# EAGLE design Ideamart_NB-IoT_DevBoard_v1.1 (EAGLE 8.7.1)

## Sheet 1 of 4
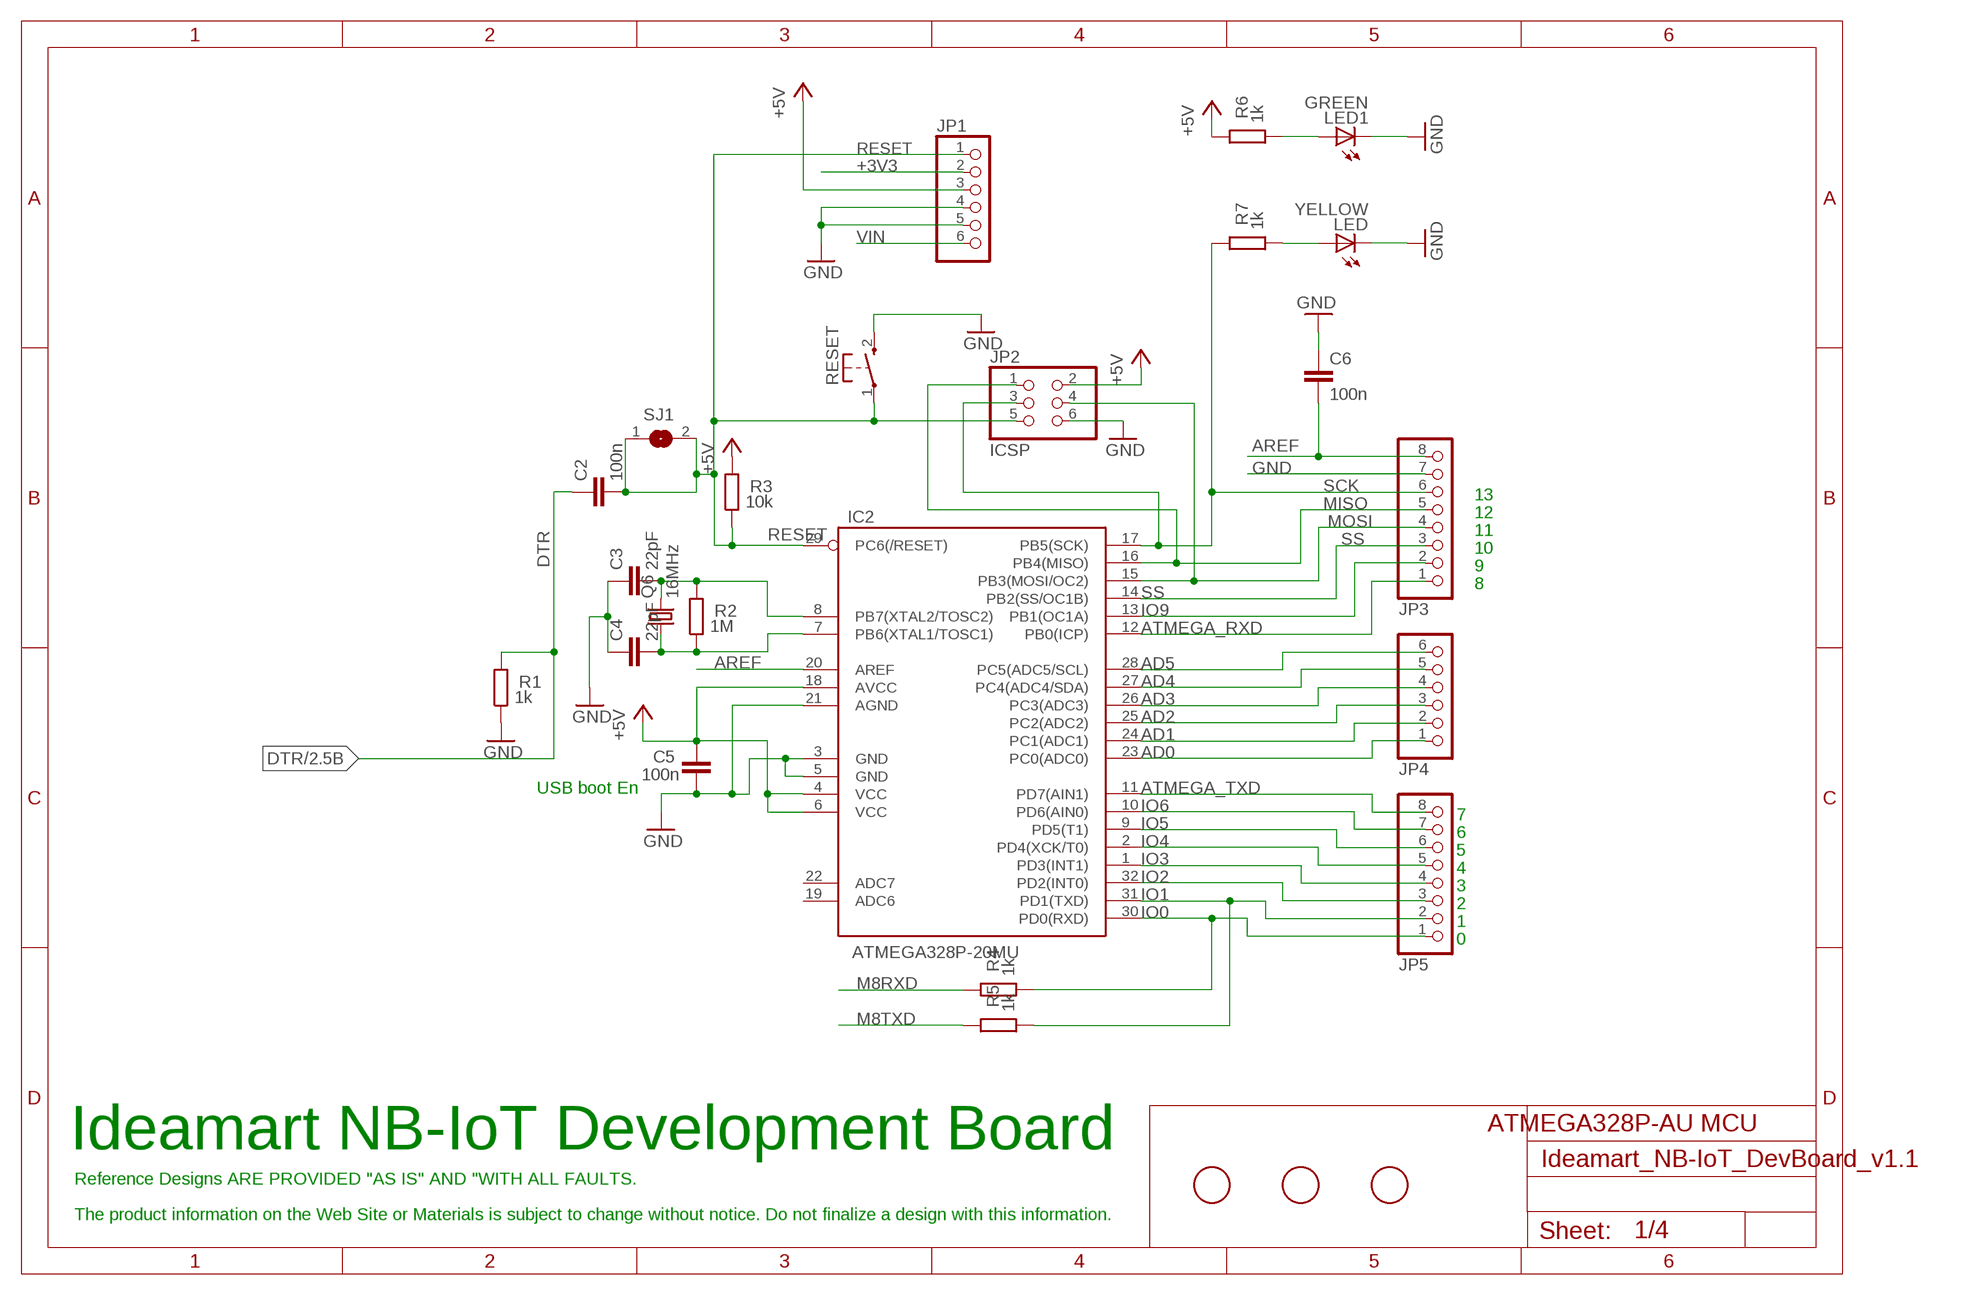
[diagram p0: schematic, sheet 1]

### Parts
C2  100n  C-EUC0805  [C0805]
C3  22pF  C-EUC0805  [C0805]
C4  22pF  C-EUC0805  [C0805]
C5  100n  C-EUC0805  [C0805]
C6  100n  C-EUC0805  [C0805]
IC2  ATMEGA328P-20MU  MEGA8-AI  [TQFP32-08]
JP1  PINHD-1X6  [1X06]
JP2  ICSP  PINHD-2X3  [2X03]
JP3  PINHD-1X8  [1X08]
JP4  PINHD-1X6  [1X06]
JP5  PINHD-1X8  [1X08]
LED  YELLOW  LEDCHIP-LED0805  [CHIP-LED0805]
LED1  GREEN  LEDCHIP-LED0805  [CHIP-LED0805]
M1  FIDUCIALMOUNT  [FIDUCIA-MOUNT]
M2  FIDUCIALMOUNT  [FIDUCIA-MOUNT]
M3  FIDUCIALMOUNT  [FIDUCIA-MOUNT]
Q6  16MHz  CRYSTALCTS406  [CTS406]
R1  1k  R-EU_R0805  [R0805]
R2  1M  R-EU_R0805  [R0805]
R3  10k  R-EU_R0805  [R0805]
R4  1k  R-EU_R0805  [R0805]
R5  1k  R-EU_R0805  [R0805]
R6  1k  R-EU_R0805  [R0805]
R7  1k  R-EU_R0805  [R0805]
RESET  KSS-2EG4430  [KSS-2EG4430]
SJ1  SJ  [SJ]

### Nets
+3V3: JP1.2 ; also sheet 3
+5V [usbvcc]: C5.2 IC2.4(VCC) IC2.6(VCC) IC2.18(AVCC) JP1.3 JP2.2 R3.2 R6.2 ; also sheet 2,3,4
AD0: IC2.23(PC0(ADC0)) JP4.1
AD1: IC2.24(PC1(ADC1)) JP4.2
AD2: IC2.25(PC2(ADC2)) JP4.3
AD3: IC2.26(PC3(ADC3)) JP4.4
AD4: IC2.27(PC4(ADC4/SDA)) JP4.5
AD5: IC2.28(PC5(ADC5/SCL)) JP4.6
AREF [aref]: C6.2 IC2.20(AREF) JP3.8
ATMEGA_RXD: IC2.12(PB0(ICP)) JP3.1 ; also sheet 4
ATMEGA_TXD: IC2.11(PD7(AIN1)) JP5.8 ; also sheet 4
DTR: C2.1 R1.2 ; also sheet 2
GND [gnd]: C3.1 C4.1 C5.1 C6.1 IC2.3(GND) IC2.5(GND) IC2.21(AGND) JP1.4 JP1.5 JP2.6 JP3.7 LED1.C LED.C R1.1 RESET.2(S) ; also sheet 2,3,4
IO0: IC2.30(PD0(RXD)) JP5.1 R4.1
IO1: IC2.31(PD1(TXD)) JP5.2 R5.1
IO2: IC2.32(PD2(INT0)) JP5.3
IO3: IC2.1(PD3(INT1)) JP5.4
IO4: IC2.2(PD4(XCK/T0)) JP5.5
IO5: IC2.9(PD5(T1)) JP5.6
IO6: IC2.10(PD6(AIN0)) JP5.7
IO9: IC2.13(PB1(OC1A)) JP3.2
M8RXD: R4.2 ; also sheet 2
M8TXD: R5.2 ; also sheet 2
MISO: IC2.16(PB4(MISO)) JP2.1 JP3.5
MOSI: IC2.15(PB3(MOSI/OC2)) JP2.4 JP3.4 ; also sheet 4
N$1: LED.A R7.1
N$3: LED1.A R6.1
RESET: C2.2 IC2.29(PC6(/RESET)) JP1.1 JP2.5 R3.1 RESET.1(P) SJ1.1 SJ1.2
SCK: IC2.17(PB5(SCK)) JP2.3 JP3.6 R7.2 ; also sheet 4
SS: IC2.14(PB2(SS/OC1B)) JP3.3
VIN [power]: JP1.6 ; also sheet 3
XTAL1: C4.2 IC2.7(PB6(XTAL1/TOSC1)) Q6.1 R2.1
XTAL2: C3.2 IC2.8(PB7(XTAL2/TOSC2)) Q6.3 R2.2
Unconnected: IC2.19(ADC6) IC2.22(ADC7)

### Notes on the sheet
- 13
- 12
- 11
- 10
- 9
- 8
- USB boot En
- 7
- 6
- 5
- 4
- 3
- 2
- 1
- 0
- ATMEGA328P-AU MCU
- Ideamart NB-IoT Development Board
- Reference Designs ARE PROVIDED "AS IS" AND "WITH ALL FAULTS.
- The product information on the Web Site or Materials is subject to change without notice. Do not finalize a design with this information.

## Sheet 2 of 4
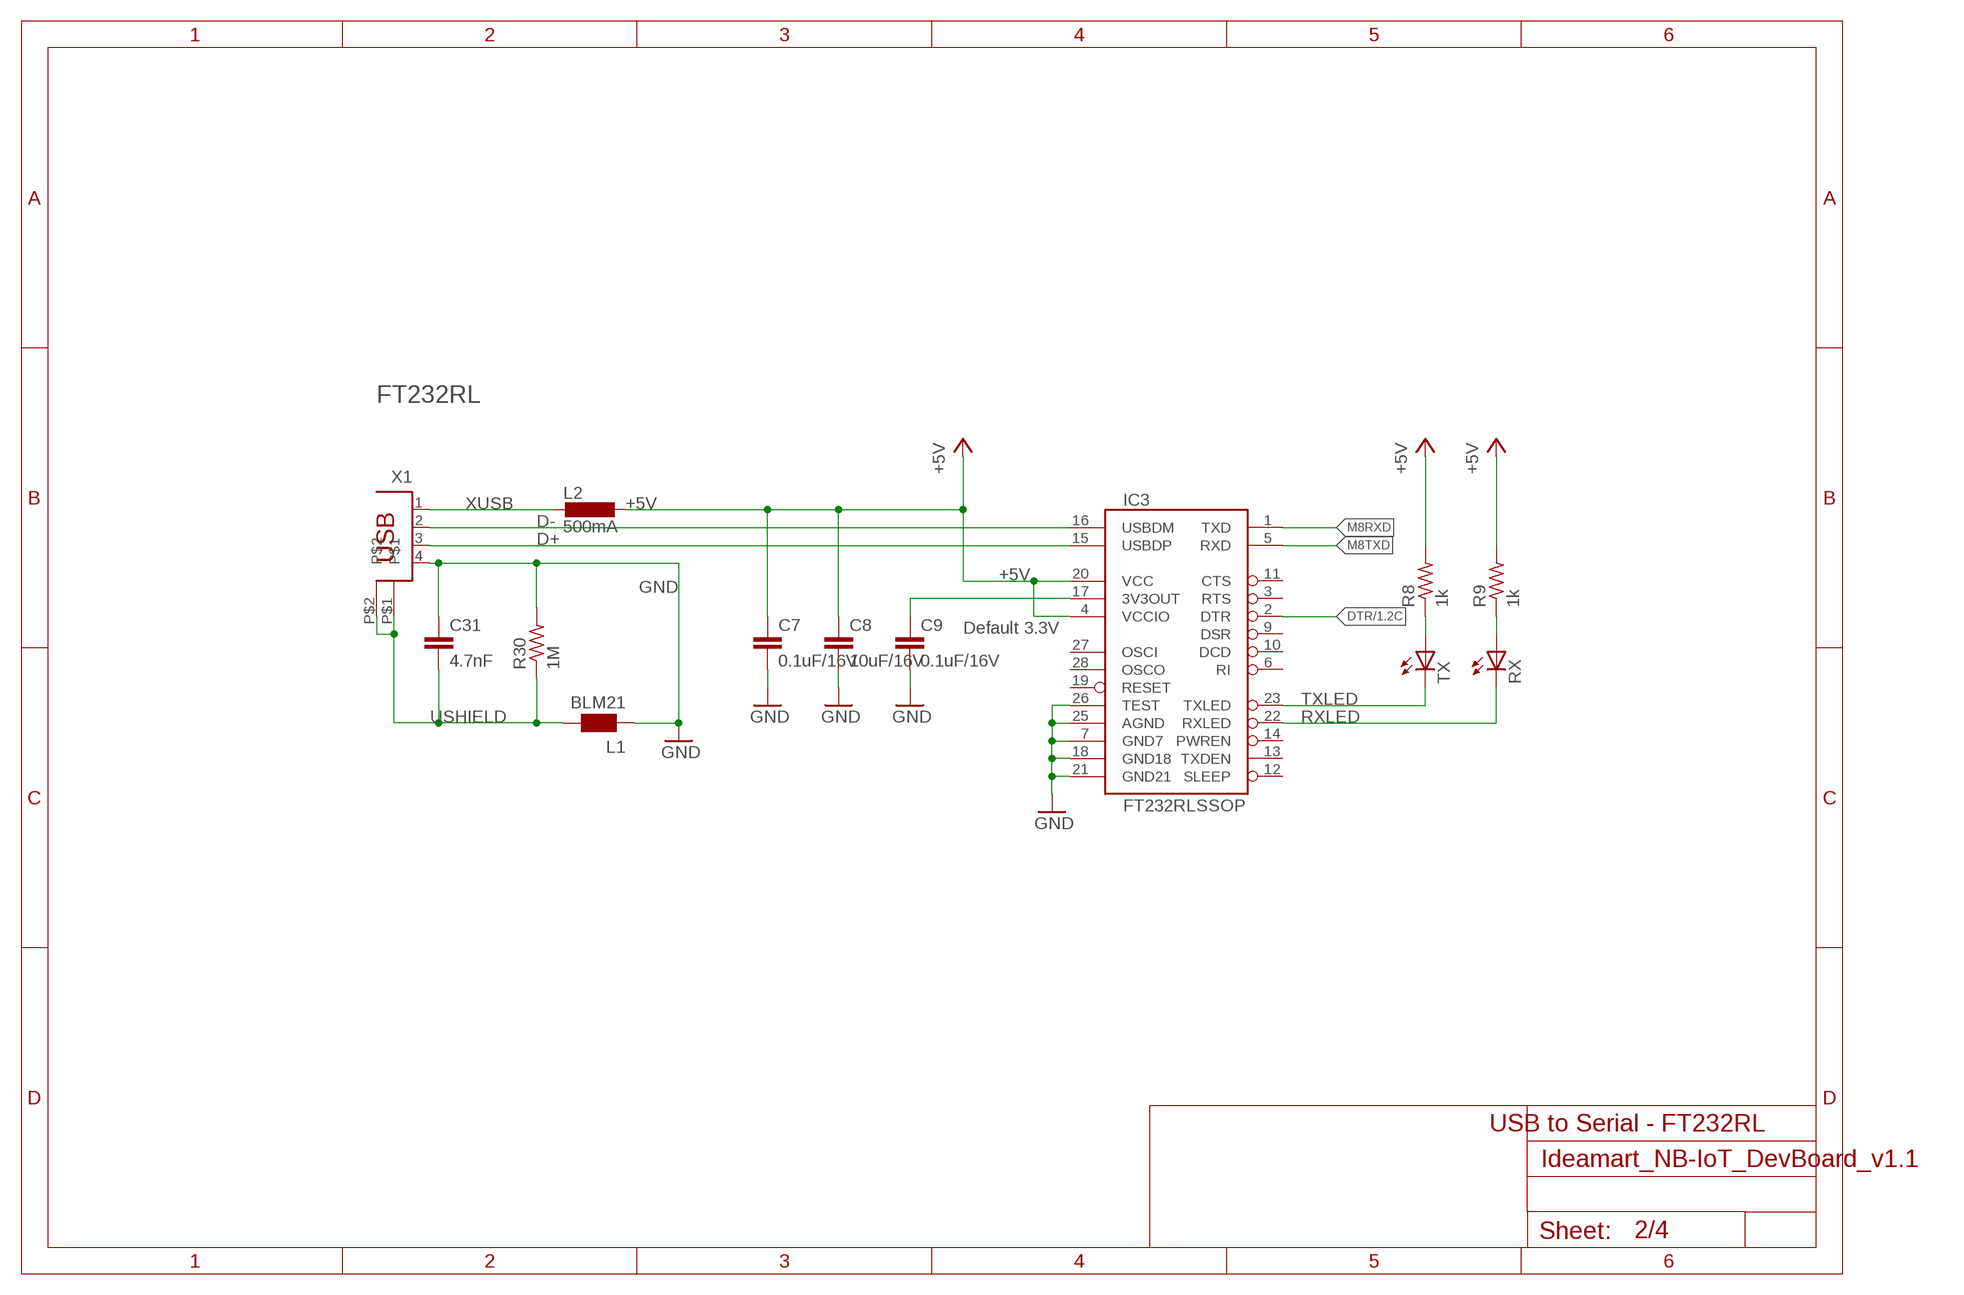
[diagram p1: schematic, sheet 2]

### Parts
C7  0.1uF/16V  C-EUC0805K  [C0805K]
C8  10uF/16V  C-EUC0805K  [C0805K]
C9  0.1uF/16V  C-EUC0805K  [C0805K]
C31  4.7nF  C-EUC0805K  [C0805K]
IC3  FT232RLSSOP  [SSOP28DB]
L1  BLM21  WE-CBF_0805  [0805]
L2  500mA  L-EUL1812  [L1812]
R8  1k  R-US_M0805  [M0805]
R9  1k  R-US_M0805  [M0805]
R30  1M  R-US_M0805  [M0805]
RX  LEDCHIP-LED0805  [CHIP-LED0805]
TX  LEDCHIP-LED0805  [CHIP-LED0805]
X1  PN61729  [PN61729]

### Nets
+5V [usbvcc]: C7.1 C8.1 IC3.4(VCCIO) IC3.20(VCC) L2.1 R8.2 R9.2 ; also sheet 1,3,4
D+: IC3.15(USBDP) X1.3
D-: IC3.16(USBDM) X1.2
DTR: IC3.2(DTR) ; also sheet 1
GND [gnd]: C7.2 C8.2 C9.2 C31.1 IC3.7(GND7) IC3.18(GND18) IC3.21(GND21) IC3.25(AGND) IC3.26(TEST) L1.1 R30.2 X1.4 ; also sheet 1,3,4
M8RXD: IC3.1(TXD) ; also sheet 1
M8TXD: IC3.5(RXD) ; also sheet 1
N$5: C9.1 IC3.17(3V3OUT)
N$9: R8.1 TX.A
N$11: R9.1 RX.A
RXLED: IC3.22(RXLED) RX.C
TXLED: IC3.23(TXLED) TX.C
USHIELD [gnd]: C31.2 L1.2 R30.1 X1.P$1 X1.P$2
XUSB [usbvcc]: L2.2 X1.1
Unconnected: IC3.3(RTS) IC3.6(RI) IC3.9(DSR) IC3.10(DCD) IC3.11(CTS) IC3.12(SLEEP) IC3.13(TXDEN) IC3.14(PWREN) IC3.19(RESET) IC3.27(OSCI) IC3.28(OSCO)

### Notes on the sheet
- FT232RL
- Default 3.3V
- USB to Serial - FT232RL

## Sheet 3 of 4
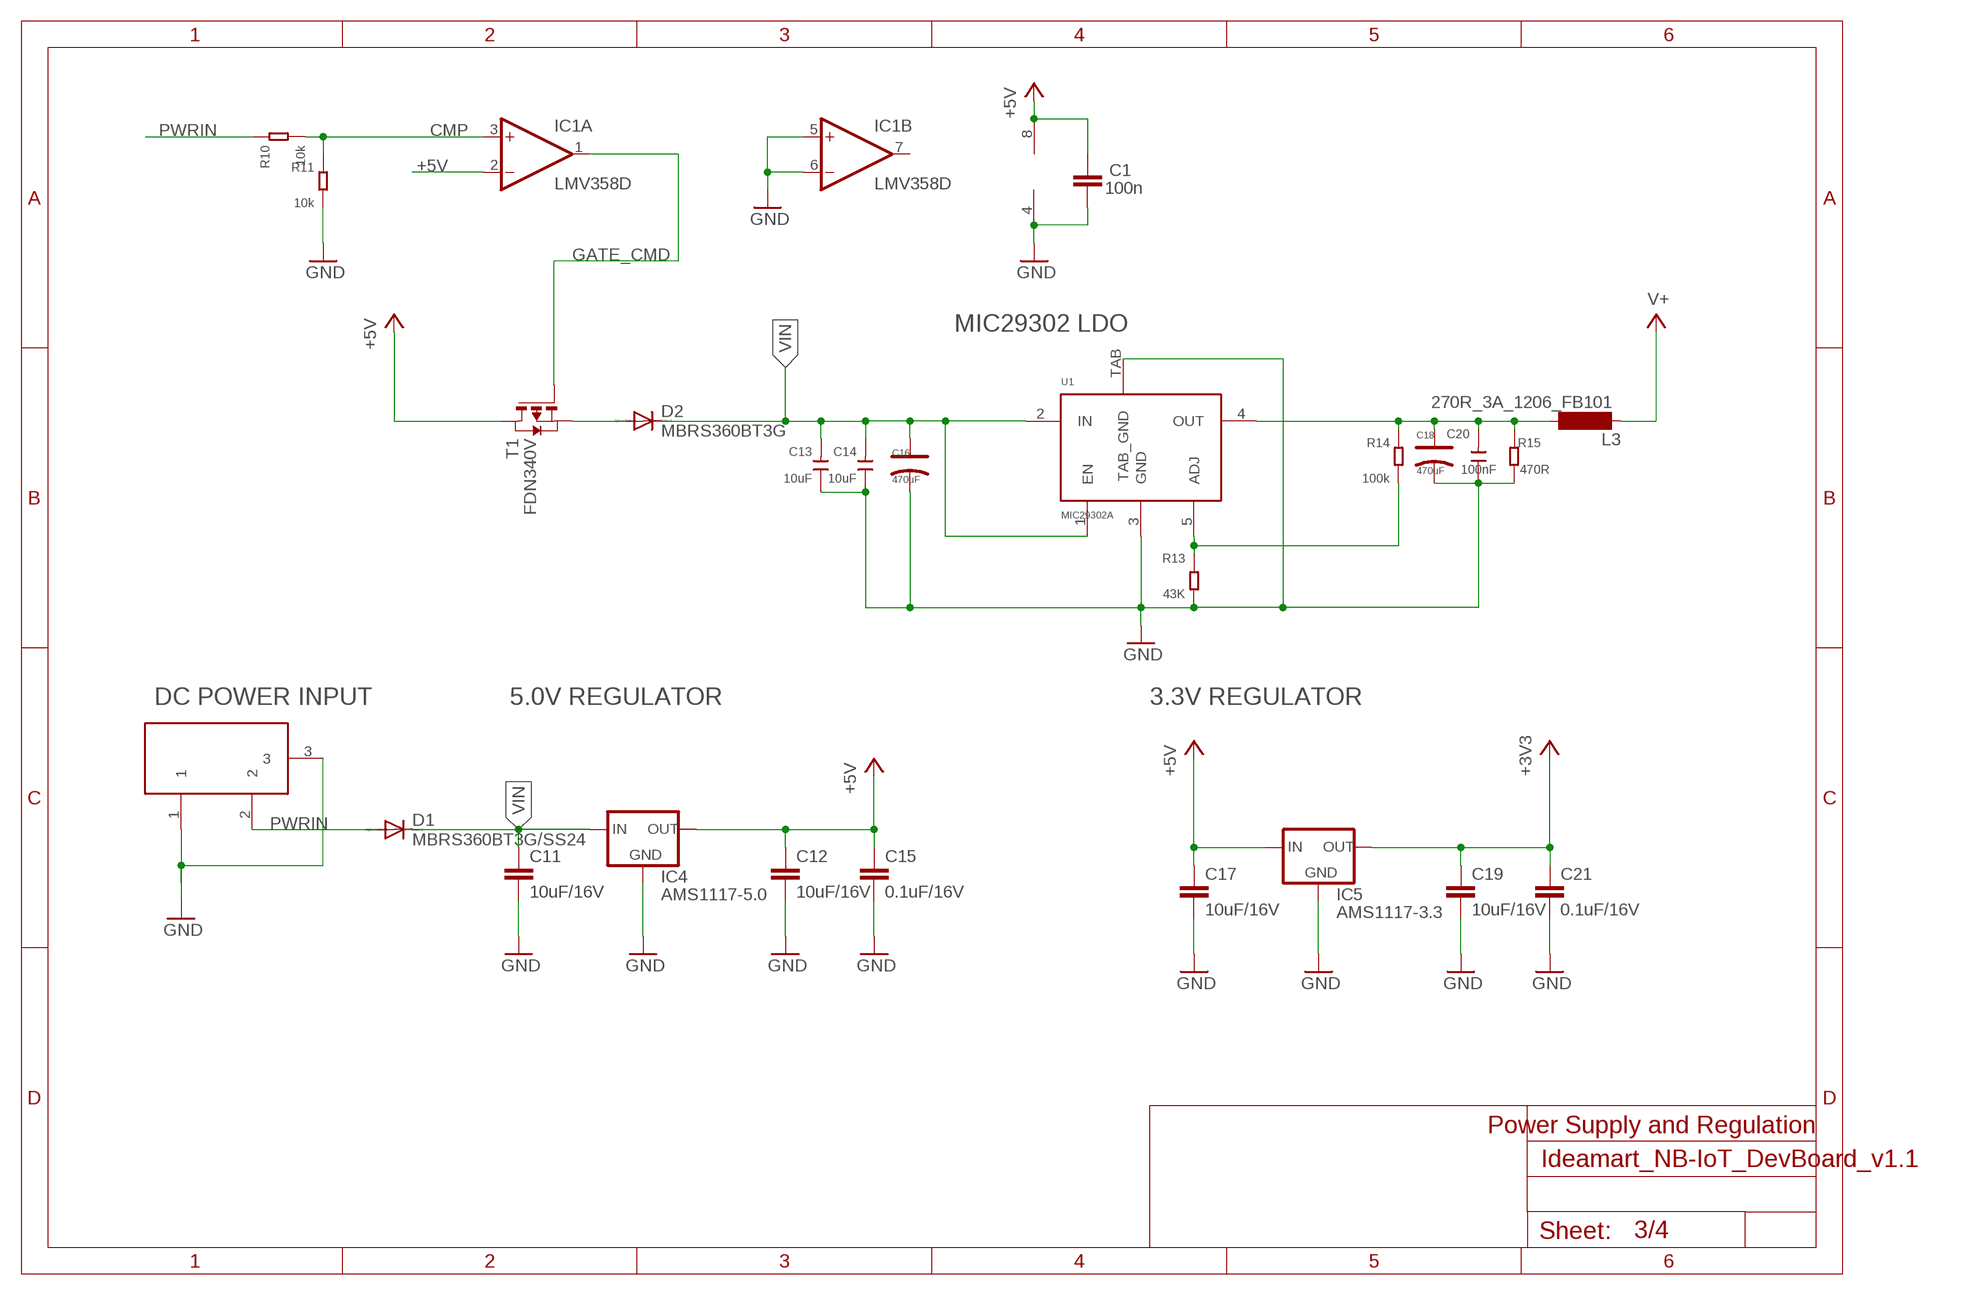
[diagram p2: schematic, sheet 3]

### Parts
C1  100n  C-EUC0805  [C0805]
C11  10uF/16V  C-EUC0805K  [C0805K]
C12  10uF/16V  C-EUC0805K  [C0805K]
C13  10uF  C-0805  [0805]
C14  10uF  C-0805  [0805]
C15  0.1uF/16V  C-EUC0805K  [C0805K]
C16  470uF  006-CAP_AVX_D  [AVX_D]
C17  10uF/16V  C-EUC0805K  [C0805K]
C18  470uF  006-CAP_AVX_D  [AVX_D]
C19  10uF/16V  C-EUC0805K  [C0805K]
C20  100nF  C-0805  [0805]
C21  0.1uF/16V  C-EUC0805K  [C0805K]
D1  MBRS360BT3G/SS24  DIODE-SMB  [SMB]
D2  MBRS360BT3G  DIODE-SMB  [SMB]
IC1  LMV358D  LM358D  [SO08]
IC4  AMS1117-5.0  LM1117  [SOT223]
IC5  AMS1117-3.3  LM1117  [SOT223]
L3  270R_3A_1206_FB101  SM-1206  [SM-1206]
R10  10k  R-0805  [0805]
R11  10k  R-0805  [0805]
R13  43K  R-0805  [0805]
R14  100k  R-0805  [0805]
R15  470R  R-0805  [0805]
T1  FDN340V  PMOSSOT23  [SOT-23]
U1  MIC29302A  [TO-263A]
X3  DC21MMX  [DC-21MM]

### Nets
+3V3: C19.1 C21.1 IC5.2(OUT) ; also sheet 1
+5V [usbvcc]: C1.2 C12.1 C15.1 C17.1 IC1.2(A:-IN) IC1.8(P:V+) IC4.2(OUT) IC5.3(IN) T1.1(D) ; also sheet 1,2,4
CMP: IC1.3(A:+IN) R10.1 R11.2
GATE_CMD: IC1.1(A:OUT) T1.3(G)
GND [gnd]: C1.1 C11.2 C12.2 C13.1 C14.1 C15.2 C16.- C17.2 C18.- C19.2 C20.1 C21.2 IC1.4(P:V-) IC1.5(B:+IN) IC1.6(B:-IN) IC4.1(GND) IC5.1(GND) R11.1 R13.1 R15.1 U1.3(GND) U1.TAB(TAB_GND) X3.1 X3.3 ; also sheet 1,2,4
N$2: R13.2 R14.1 U1.5(ADJ)
N$4: D2.A T1.2(S)
PWRIN [power]: D1.A R10.2 X3.2
V+: L3.1 ; also sheet 4
VIN [power]: C11.1 C13.2 C14.2 C16.+ D1.C D2.C IC4.3(IN) U1.1(EN) U1.2(IN) ; also sheet 1
VOUT: C18.+ C20.2 L3.2 R14.2 R15.2 U1.4(OUT)
Unconnected: IC1.7(B:OUT)

### Notes on the sheet
- MIC29302 LDO
- DC POWER INPUT | 5.0V REGULATOR | 3.3V REGULATOR
- Power Supply and Regulation

## Sheet 4 of 4
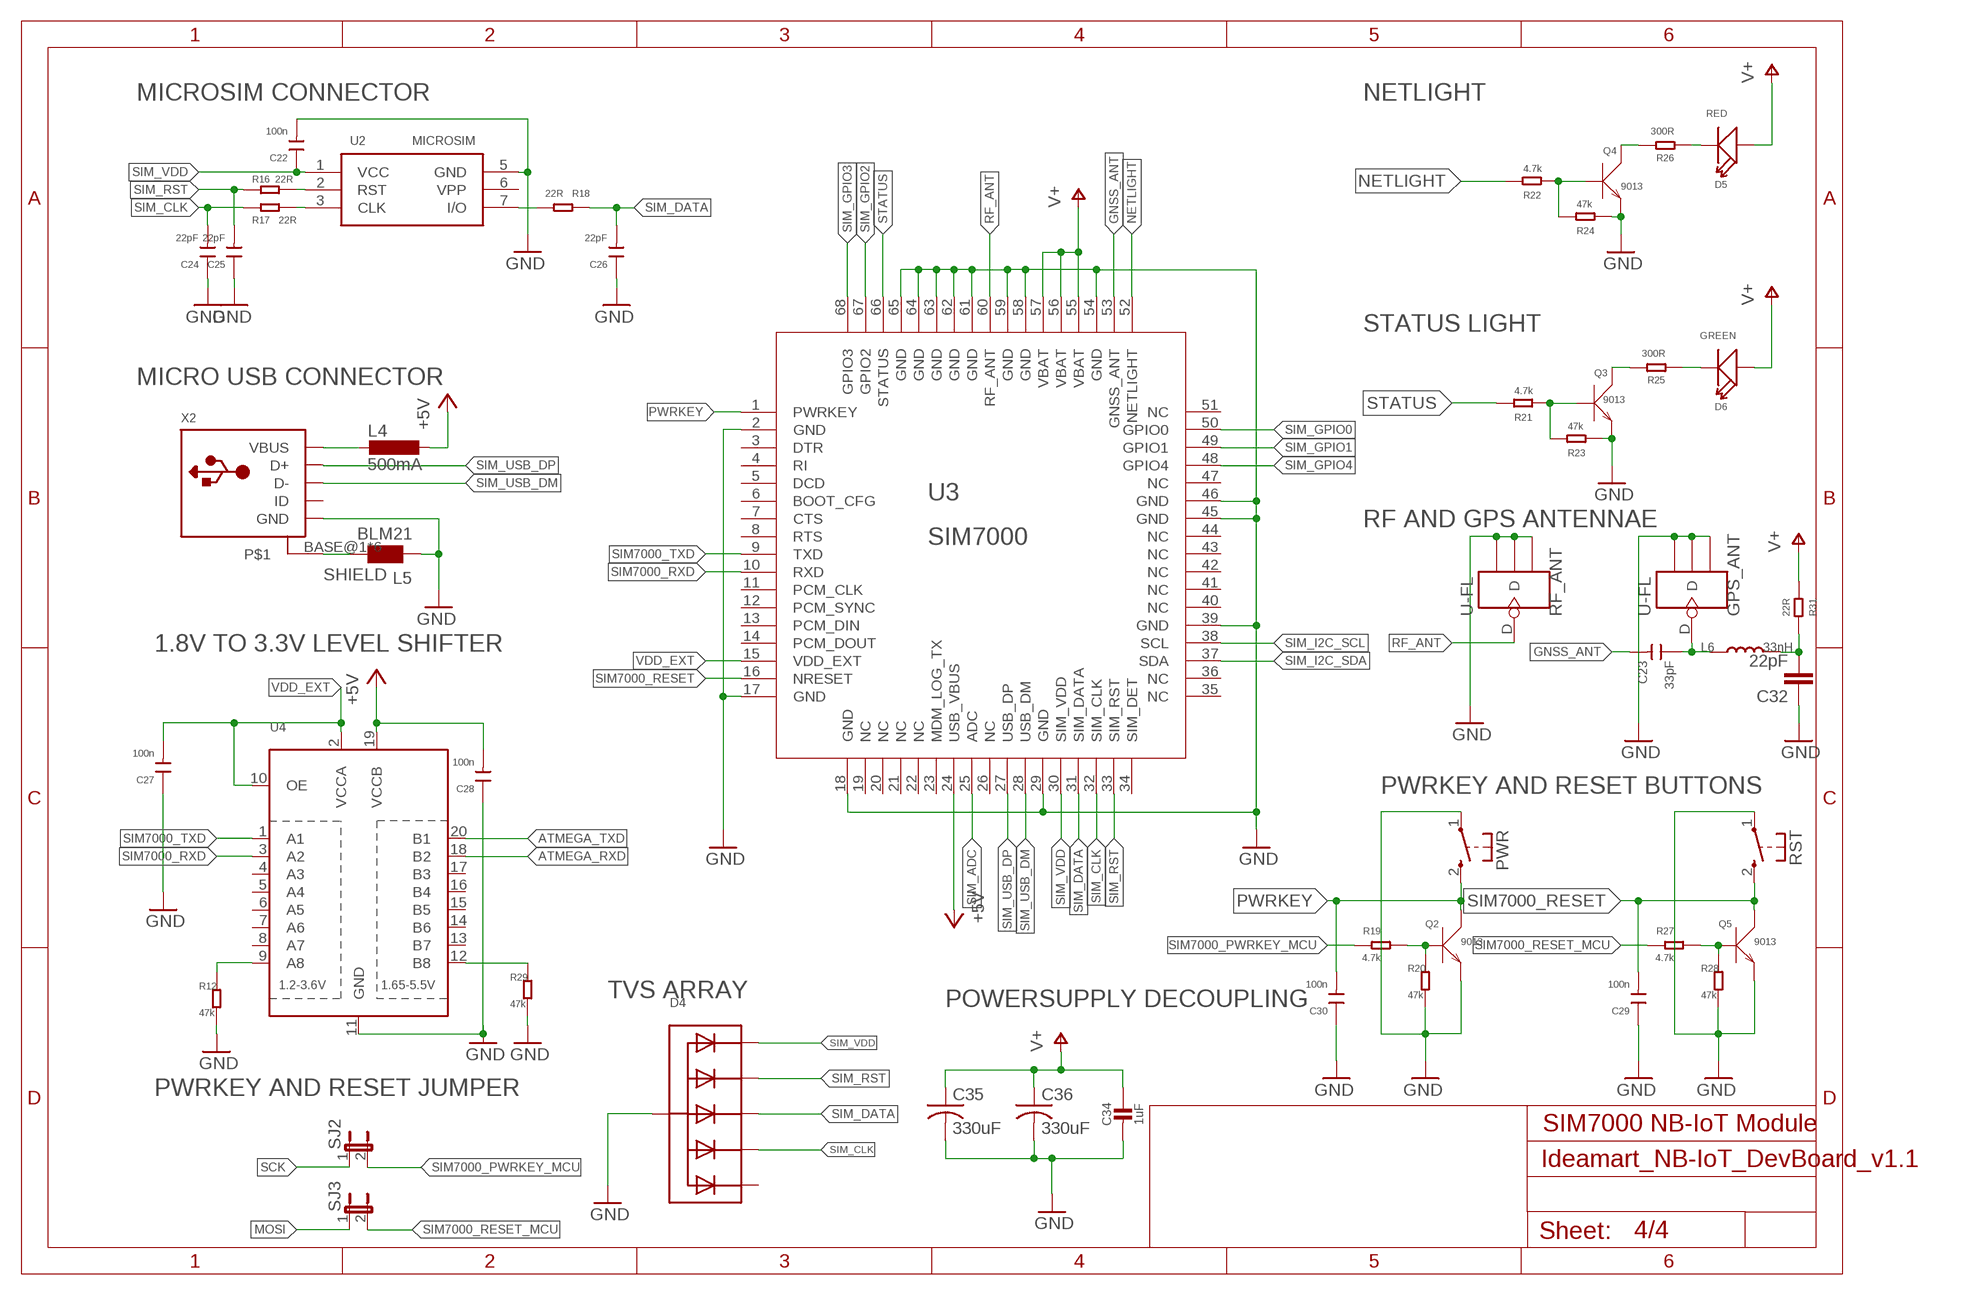
[diagram p3: schematic, sheet 4]

### Parts
C22  100n  C-0805  [0805]
C23  33pF  C-0805  [0805]
C24  22pF  C-0805  [0805]
C25  22pF  C-0805  [0805]
C26  22pF  C-0805  [0805]
C27  100n  C-0805  [0805]
C28  100n  C-0805  [0805]
C29  100n  C-0805  [0805]
C30  100n  C-0805  [0805]
C32  22pF  C-EUC0805  [C0805]
C34  1uF  CAP_CERAMIC_0805  [_0805]
C35  330uF  C-USC1210  [C1210]
C36  330uF  C-USC1210  [C1210]
D4  TVSARRAY_5LANE  [SOT363]
D5  RED  LED'0805'  [LED-0805]
D6  GREEN  LED'0805'  [LED-0805]
GPS_ANT  U-FL  ANTENNA-U-FL  [4P-U-FL]
L4  500mA  L-EUL1812  [L1812]
L5  BLM21  WE-CBF_0805  [0805]
L6  33nH  L0805  [L0805]
PWR  KSS-2EG4430  [KSS-2EG4430]
Q2  9013  TRANSISTOR-NPN-SOT23  [SOT23]
Q3  9013  TRANSISTOR-NPN-SOT23  [SOT23]
Q4  9013  TRANSISTOR-NPN-SOT23  [SOT23]
Q5  9013  TRANSISTOR-NPN-SOT23  [SOT23]
R12  47k  R-0805  [0805]
R16  22R  R-0805  [0805]
R17  22R  R-0805  [0805]
R18  22R  R-0805  [0805]
R19  4.7k  R-0805  [0805]
R20  47k  R-0805  [0805]
R21  4.7k  R-0805  [0805]
R22  4.7k  R-0805  [0805]
R23  47k  R-0805  [0805]
R24  47k  R-0805  [0805]
R25  300R  R-0805  [0805]
R26  300R  R-0805  [0805]
R27  4.7k  R-0805  [0805]
R28  47k  R-0805  [0805]
R29  47k  R-0805  [0805]
R31  22R  R-0805  [0805]
RF_ANT  U-FL  ANTENNA-U-FL  [4P-U-FL]
RST  KSS-2EG4430  [KSS-2EG4430]
SJ2  SPARKFUN-PASSIVES_JUMPER-PTH-2-NC  [SPARKFUN-PASSIVES_PTH-JUMPER-NC_BOTTOM_NO_SILK]
SJ3  SPARKFUN-PASSIVES_JUMPER-PTH-2-NC  [SPARKFUN-PASSIVES_PTH-JUMPER-NC_BOTTOM_NO_SILK]
U2  MICROSIM  [MICROSIM]
U3  SIM7000  [SIM7000]
U4  TXB0108PWR  [TSSOP20]
X2  USB_MICRO_20329_V2  [4UCONN_20329_V2]

### Nets
+5V [usbvcc]: C28.2 L4.1 U3.24(USB_VBUS) U4.19(VCCB) ; also sheet 1,2,3
ATMEGA_RXD: U4.18(B2) ; also sheet 1
ATMEGA_TXD: U4.20(B1) ; also sheet 1
GND [gnd]: C22.2 C24.1 C25.1 C26.1 C27.1 C28.1 C29.1 C30.1 C32.1 C34.2 C35.2 C36.2 D4.2(A) GPS_ANT.GND1 GPS_ANT.GND2 GPS_ANT.GND3 L5.1 PWR.1(P) Q2.2(E) Q3.2(E) Q4.2(E) Q5.2(E) R12.2 R20.2 R23.2 R24.2 R28.2 R29.2 RF_ANT.GND1 RF_ANT.GND2 RF_ANT.GND3 RST.1(P) U2.5(GND) U3.2(GND) U3.17(GND) U3.18(GND) U3.29(GND) U3.39(GND) U3.45(GND) U3.46(GND) U3.54(GND) U3.58(GND) U3.59(GND) U3.61(GND) U3.62(GND) U3.63(GND) U3.64(GND) U3.65(GND) U4.11(GND) X2.GND ; also sheet 1,2,3
GNSS_ANT [antenna]: C23.2 U3.53(GNSS_ANT)
MOSI: SJ3.1 ; also sheet 1
N$6: Q3.3(C) R25.2
N$7: D6.- R25.1
N$8: Q3.1(B) R21.2 R23.1
N$10: R18.2 U2.7(I/O)
N$12: R17.1 U2.3(CLK)
N$13: R16.1 U2.2(RST)
N$14: Q5.1(B) R27.2 R28.1
N$15: L4.2 X2.VBUS
N$16: Q4.3(C) R26.2
N$17: D5.- R26.1
N$18: Q4.1(B) R22.2 R24.1
N$19 [antenna]: C23.1 GPS_ANT.D L6.1
N$20: R12.1 U4.9(A8)
N$21: R29.1 U4.12(B8)
N$22: C32.2 L6.2 R31.1
N$36: Q2.1(B) R19.2 R20.1
NETLIGHT: R22.1 U3.52(NETLIGHT)
PWRKEY: C30.2 PWR.2(S) Q2.3(C) U3.1(PWRKEY)
RF_ANT [antenna]: RF_ANT.D U3.60(RF_ANT)
SCK: SJ2.1 ; also sheet 1
SHIELD: L5.2 X2.BASE@1 X2.BASE@2 X2.SPRT@1 X2.SPRT@2 X2.SPRT@3 X2.SPRT@4
SIM7000_PWRKEY_MCU: R19.1 SJ2.2
SIM7000_RESET: C29.2 Q5.3(C) RST.2(S) U3.16(NRESET)
SIM7000_RESET_MCU: R27.1 SJ3.2
SIM7000_RXD: U3.10(RXD) U4.3(A2)
SIM7000_TXD: U3.9(TXD) U4.1(A1)
SIM_ADC: U3.25(ADC)
SIM_CLK: C24.2 D4.5(C4) R17.2 U3.32(SIM_CLK)
SIM_DATA: C26.2 D4.4(C3) R18.1 U3.31(SIM_DATA)
SIM_GPIO0: U3.50(GPIO0)
SIM_GPIO1: U3.49(GPIO1)
SIM_GPIO2: U3.67(GPIO2)
SIM_GPIO3: U3.68(GPIO3)
SIM_GPIO4: U3.48(GPIO4)
SIM_I2C_SCL: U3.38(SCL)
SIM_I2C_SDA: U3.37(SDA)
SIM_RST: C25.2 D4.3(C2) R16.2 U3.33(SIM_RST)
SIM_USB_DM: U3.28(USB_DM) X2.D-
SIM_USB_DP: U3.27(USB_DP) X2.D+
SIM_VDD: C22.1 D4.1(C1) U2.1(VCC) U3.30(SIM_VDD)
STATUS: R21.1 U3.66(STATUS)
V+: C34.1 C35.1 C36.1 D5.+ D6.+ R31.2 U3.55(VBAT) U3.56(VBAT) U3.57(VBAT) ; also sheet 3
VDD_EXT: C27.2 U3.15(VDD_EXT) U4.2(VCCA) U4.10(OE)
Unconnected: D4.6(C5) U2.6(VPP) U3.3(DTR) U3.4(RI) U3.5(DCD) U3.6(BOOT_CFG) U3.7(CTS) U3.8(RTS) U3.11(PCM_CLK) U3.12(PCM_SYNC) U3.13(PCM_DIN) U3.14(PCM_DOUT) U3.19(NC) U3.20(NC) U3.21(NC) U3.22(NC) U3.23(MDM_LOG_TX) U3.26(NC) U3.34(SIM_DET) U3.35(NC) U3.36(NC) U3.40(NC) U3.41(NC) U3.42(NC) U3.43(NC) U3.44(NC) U3.47(NC) U3.51(NC) U4.4(A3) U4.5(A4) U4.6(A5) U4.7(A6) U4.8(A7) U4.13(B7) U4.14(B6) U4.15(B5) U4.16(B4) U4.17(B3) X2.ID

### Notes on the sheet
- MICROSIM CONNECTOR | NETLIGHT
- STATUS LIGHT
- MICRO USB CONNECTOR
- RF AND GPS ANTENNAE
- 1.8V TO 3.3V LEVEL SHIFTER
- PWRKEY AND RESET BUTTONS
- TVS ARRAY
- POWERSUPPLY DECOUPLING
- PWRKEY AND RESET JUMPER
- SIM7000 NB-IoT Module

## Library data of the parts
C1-C6 C32 = SmartPrj:C-EU: CAPACITOR, European symbol
C7-C9 C11 C12 C15 C17 C19 C21 C31 = rcl:C-EU: CAPACITOR, European symbol
C13 C14 C20 C22-C30 = discrete:C*: Ceramic Capacitors
C16 C18 = discrete:006-CAP*: Electrolytic Capacitors,Tantalum Capacitors and Super Capacitors
C34 = Adafruit111:CAP_CERAMIC: Ceramic Capacitors For new designs, use the packages preceded by an '_' character since they are more reliable: The following footprints should be used on most boards: _0402 - Standard footprint for regular board layouts _0603 - Standard footprint for regular board layouts _0805 - Standard footprint for regular board layouts _1206 - Standard footprint for regular board layouts For extremely tight-pitch boards where space is at a premium, the following 'micro-pitch' footprints can be used (smaller pads, no silkscreen outline, etc.): _0402MP - Micro-pitch footprint for very dense/compact boards _0603MP - Micro-pitch footprint for very dense/compact boards _0805MP - Micro-pitch footprint for very dense/compact boards _1206MP - Micro-pitch footprint for very dense/compact boards
C35 C36 = Adafruit SIM808 Breakout:C-US: CAPACITOR, American symbol
D1 D2 = diode:DIODE-: DIODE
D4 = Adafruit SIM808 Breakout:TVSARRAY_5LANE: Voltage Transient Suppressor Array SOT363 SMF05C - 100W 5V: Digikey - SMF05CT1GOSCT-ND
D5 D6 = discrete:LED*
GPS_ANT RF_ANT = Connector:ANTENNA-U-FL
IC1 = linear:LM358: OP AMP also LM158; LM258; LM2904 Source: http://cache.national.com/ds/LM/LM158.pdf
IC2 = idii:MEGA8: MICROCONTROLLER 8 Kbytes FLASH 1 kbytes SRAM 512 bytes EEPROM USART 6-channel 10 bit ADC 2-channel 8 bit ADC Source: avr.lbr
IC3 = FTDI Basic-v21-5V:FT232RL: USB UART FT232RL 4th Generation USB UART (USB <-> Serial) Controller. Spark Fun Electronics SKU : COM-00650
IC4 IC5 = v-reg-3:LM1117
JP1 JP4 = pinhead:PINHD-1X6: PIN HEADER
JP2 = pinhead:PINHD-2X3: PIN HEADER
JP3 JP5 = pinhead:PINHD-1X8: PIN HEADER
L1 L5 = wuerth-elektronik:WE-CBF: SMD EMI Suppression Ferrite Beads - excellent anti-EMI properties - low DCR - impedances till 3000 ohms - rated current up to 6 A
L2 L4 = rcl:L-EU: INDUCTOR, European symbol
L3 = inductor-neosid:SM-1206: INDUCTOR SMD chip inductor; OC_FARNELL: unknown; OC_NEWARK: unknown
L6 = GPRS+GSM+GPS Shield v1.0:L*
LED LED1 RX TX = led:LED: LED OSRAM: - CHIPLED LG R971, LG N971, LY N971, LG Q971, LY Q971, LO R971, LY R971 LH N974, LH R974 LS Q976, LO Q976, LY Q976 LO Q996 - Hyper CHIPLED LW Q18S LB Q993, LB Q99A, LB R99A - SideLED LS A670, LO A670, LY A670, LG A670, LP A670 LB A673, LV A673, LT A673, LW A673 LH A674 LY A675 LS A676, LA A676, LO A676, LY A676, LW A676 LS A679, LY A679, LG A679 - Hyper Micro SIDELED® LS Y876, LA Y876, LO Y876, LY Y876 LT Y87S - SmartLED LW L88C, LW L88S LB L89C, LB L89S, LG L890 LS L89K, LO L89K, LY L89K LS L896, LA L896, LO L896, LY L896 - TOPLED LS T670, LO T670, LY T670, LG T670, LP T670 LSG T670, LSP T670, LSY T670, LOP T670, LYG T670 LG T671, LOG T671, LSG T671 LB T673, LV T673, LT T673, LW T673 LH T674 LS T676, LA T676, LO T676, LY T676, LB T676, LH T676, LSB T676, LW T676 LB T67C, LV T67C, LT T67C, LS T67K, LO T67K, LY T67K, LW E67C LS E67B, LA E67B, LO E67B, LY E67B, LB E67C, LV E67C, LT E67C LW T67C LS T679, LY T679, LG T679 LS T770, LO T770, LY T770, LG T770, LP T770 LB T773, LV T773, LT T773, LW T773 LH T774 LS E675, LA E675, LY E675, LS T675 LS T776, LA T776, LO T776, LY T776, LB T776 LHGB T686 LT T68C, LB T68C - Hyper Mini TOPLED® LB M676 - Mini TOPLED Santana® LG M470 LS M47K, LO M47K, LY M47K Source: http://www.osram.convergy.de LUXEON: - LUMILED® LXK2-PW12-R00, LXK2-PW12-S00, LXK2-PW14-U00, LXK2-PW14-V00 LXK2-PM12-R00, LXK2-PM12-S00, LXK2-PM14-U00 LXK2-PE12-Q00, LXK2-PE12-R00, LXK2-PE12-S00, LXK2-PE14-T00, LXK2-PE14-U00 LXK2-PB12-K00, LXK2-PB12-L00, LXK2-PB12-M00, LXK2-PB14-N00, LXK2-PB14-P00, LXK2-PB14-Q00 LXK2-PR12-L00, LXK2-PR12-M00, LXK2-PR14-Q00, LXK2-PR14-R00 LXK2-PD12-Q00, LXK2-PD12-R00, LXK2-PD12-S00 LXK2-PH12-R00, LXK2-PH12-S00 LXK2-PL12-P00, LXK2-PL12-Q00, LXK2-PL12-R00 Source: www.luxeon.com KINGBRIGHT: KA-3528ASYC Source: www.kingbright.com
M1-M3 = SmartPrj:FIDUCIALMOUNT
PWR RESET RST = buttons:KSS-2EG4430: Size: 3x6mm Height: 5mm from PCB Rating: DC12v 50mA Travel: 0.25±0.10mm Operating Force: 180±50gf Return Force: 60gf min Contact resistance: 100m? max Insulation resistance: 100M? min Operating life?50,000 cycles
Q2-Q5 = discrete:TRANSISTOR-NPN*: NPN audion
Q6 = crystal:CRYSTAL: CRYSTAL; OC_FARNELL: unknown; OC_NEWARK: unknown
R1-R7 = SmartPrj:R-EU_: RESISTOR, European symbol
R8 R9 R30 = rcl:R-US_: RESISTOR, American symbol
R10-R29 R31 = discrete:R*
SJ1 = jumper:SJ: SMD solder JUMPER
SJ2 SJ3 = ESP8266_Sparkfun:SPARKFUN-PASSIVES_JUMPER-PTH-2-NC
T1 = zetex:PMOSSOT23: MOS FET; OC_FARNELL: unknown; OC_NEWARK: unknown
U1 = ICs_v54:MIC29302
U2 = GPRS+GSM+GPS Shield v1.0:MICROSIM
U3 = ICs_v54:SIM7000
U4 = adafruit:TXB0108PWR: 8-Bit Bi-Directional Level Shifter 1.2V-3.6V (VCCA) to 1.65V-5.5V (VCCB) bi-directional level shifter with auto direction sensing. Max data rate - VCCA 1.8V: 20Mbps (50ns), VCCA 3.3V: 100Mbps (10ns) Digikey: 296-21527-1-ND
X1 = SmartPrj:PN61729: BERG USB connector
X2 = Adafruit SIM808 Breakout:USB: USB Connectors USBMINIB - Surface Mount Female Mini-B USB Connector 4UConnector: 06564
X3 = powersupply:DC21MM

## Net classes
0 default: width 0.152 mm, clearance 0.152 mm
1 power: width 0.406 mm, drill 0.356 mm, clearance 0.152 mm
2 gnd: width 0.203 mm, drill 0.356 mm, clearance 0.152 mm
3 usbvcc: width 0.203 mm, drill 0.356 mm, clearance 0.152 mm
4 aref: width 0.203 mm, drill 0.356 mm, clearance 0.152 mm
5 antenna: width 0.33 mm, drill 0.356 mm, clearance 0.559 mm

## Board
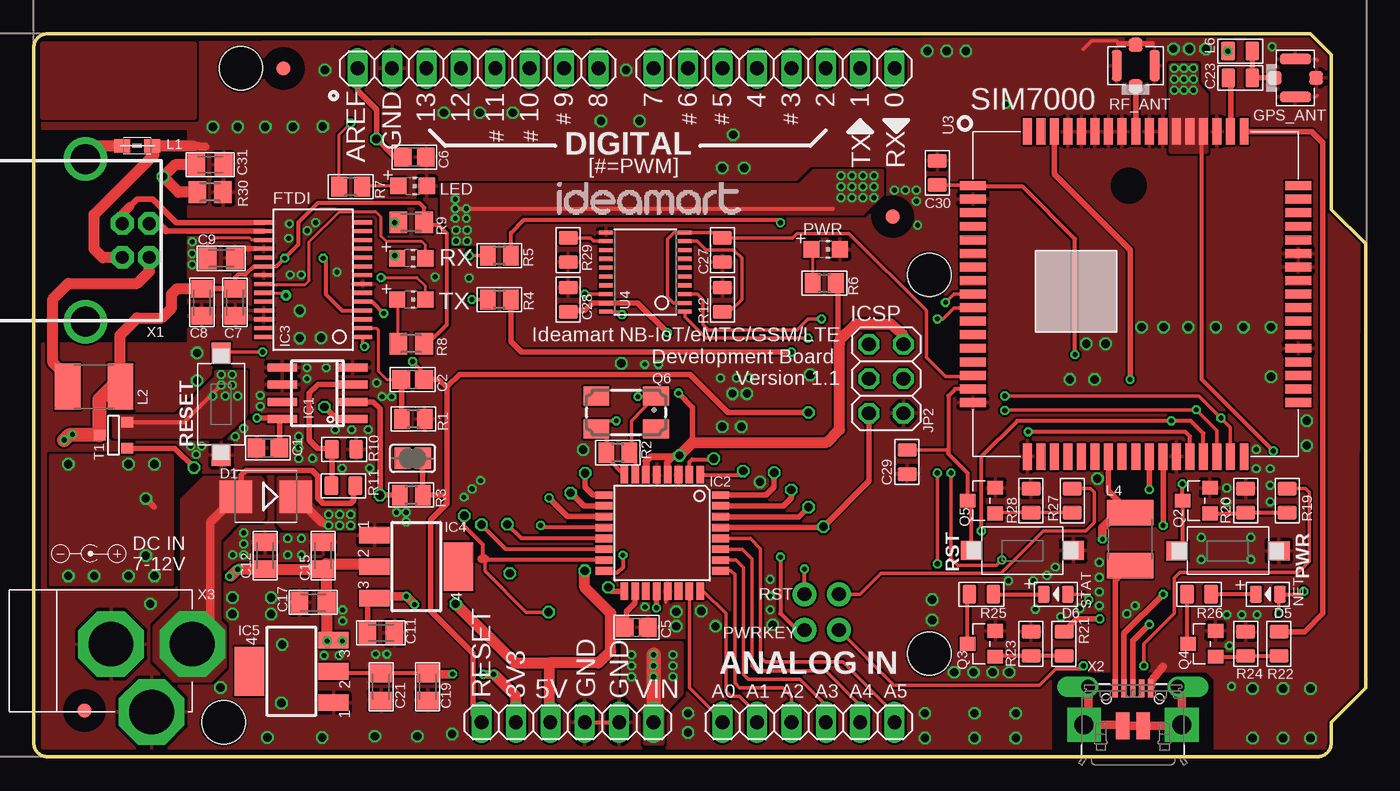
[diagram p4: board, top side]
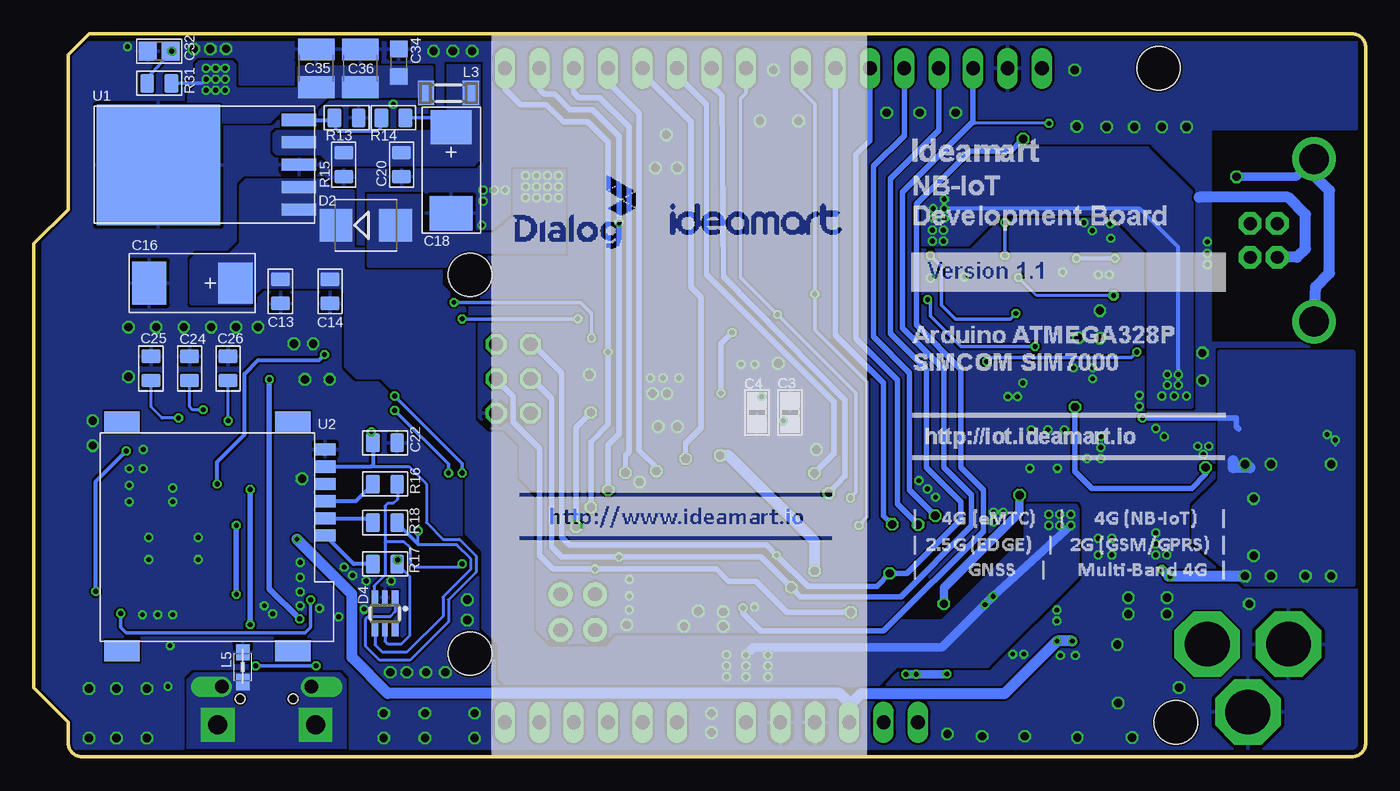
[diagram p5: board, bottom side, seen from below]

Size 98.25 x 53.34 mm. Coordinates in mm from the lower left corner, seen from the top.
Outline: 94.18,53.34 95.71,51.82 95.71,40.39 98.25,37.85 98.25,5.08 95.71,2.54 95.71,1 arc-90 94.71,0 1,0 arc-90 0,1 0,52.34 arc-90 1,53.34 94.18,53.34
Copper layers (1*16): Top 0.035mm / dielectric 1.5mm / Bottom 0.035mm
Design rules "default *": minimum track width 6mil, minimum drill 14mil, track to track 6mil, track to pad 6mil, pad to pad 6mil, via to via 6mil, smd to smd 6mil, copper to edge 6mil, drill to drill 6mil, minimum pad ring 6mil, minimum via ring 6mil, stop-mask expansion 4mil, vias tented up to drill 24mil, thermal gap 10mil
Holes 3.2 mm at 66.06,35.56 66.06,7.62 15.26,50.8 13.99,2.54
vRestrict: area 22.9,44.1 to 24.7,49.1; area 25.4,45.5 to 27.1,49.1; area 28.5,45.3 to 29.6,48.8; area 31,45.3 to 32.2,48.8; area 33.6,45.3 to 34.7,48.8; area 36.1,45.3 to 37.2,48.8; area 38.8,47.2 to 39.9,48.8; area 40.3,45.1 to 47.6,46.9; area 60.3,44.2 to 61.7,46.7; area 62.9,44.2 to 64.3,46.7; area 61.4,35.8 to 64.8,37.2; area 0.7,21.8 to 2.1,30.1; 14 more areas

### Footprints (pad centres in the part's own frame; a part is rotated, then mirrored left to right if it is on the bottom)
C0805 = smd 1.3 x 1.4: 1 -0.85,0; 2 0.85,0
C0805K = smd 1.3 x 1.6: 1 -1,0; 2 1,0
0805 = smd 1.016 x 1.397: 1 -0.889,0; 2 0.889,0
AVX_D = smd 2.54 x 3.048: + -3.175,0 | smd 2.54 x 3.175: - 3.175,0
_0805 = smd 1.2 x 1.3: 1 -1.016,0; 2 1.016,0
C1210 = smd 1.6 x 2.7: 1 -1.4,0; 2 1.4,0
SMB = smd 2.4 x 2.4: A 2.2,0; C -2.2,0
SOT363 = smd 0.5 x 1: 1 -0.75,-1.2; 3 0.75,-1.2; 4 0.75,1.2; 6 -0.75,1.2 | smd 0.4 x 1: 2 0,-1.2; 5 0,1.2
LED-0805 = smd 0.889 x 1.27: + -0.889,0; - 0.889,0
4P-U-FL = smd 1.016 x 1.016: D -1.524,0; GND3 1.524,0 | smd 2.286 x 0.762: GND1 0,1.397; GND2 0,-1.397
SO08 = smd 0.6 x 2.2: 1 -1.905,-2.6; 2 -0.635,-2.6; 3 0.635,-2.6; 4 1.905,-2.6; 5 1.905,2.6; 6 0.635,2.6; 7 -0.635,2.6; 8 -1.905,2.6
TQFP32-08 = smd 1.27 x 0.559: 1 -4.293,2.8; 2 -4.293,2; 3 -4.293,1.2; 4 -4.293,0.4; 5 -4.293,-0.4; 6 -4.293,-1.2; 7 -4.293,-2; 8 -4.293,-2.8; 17 4.293,-2.8; 18 4.293,-2; 19 4.293,-1.2; 20 4.293,-0.4; 21 4.293,0.4; 22 4.293,1.2; 23 4.293,2; 24 4.293,2.8 | smd 0.559 x 1.27: 9 -2.8,-4.293; 10 -2,-4.293; 11 -1.2,-4.293; 12 -0.4,-4.293; 13 0.4,-4.293; 14 1.2,-4.293; 15 2,-4.293; 16 2.8,-4.293; 25 2.8,4.293; 26 2,4.293; 27 1.2,4.293; 28 0.4,4.293; 29 -0.4,4.293; 30 -1.2,4.293; 31 -2,4.293; 32 -2.8,4.293
SSOP28DB = smd 0.3 x 1.397: 1 -4.225,-3.656; 2 -3.575,-3.656; 3 -2.925,-3.656; 4 -2.275,-3.656; 5 -1.625,-3.656; 6 -0.975,-3.656; 7 -0.325,-3.656; 8 0.325,-3.656; 9 0.975,-3.656; 10 1.625,-3.656; 11 2.275,-3.656; 12 2.925,-3.656; 13 3.575,-3.656; 14 4.225,-3.656; 15 4.225,3.656; 16 3.575,3.656; 17 2.925,3.656; 18 2.275,3.656; 19 1.625,3.656; 20 0.975,3.656; 21 0.325,3.656; 22 -0.325,3.656; 23 -0.975,3.656; 24 -1.625,3.656; 25 -2.275,3.656; 26 -2.925,3.656; 27 -3.575,3.656; 28 -4.225,3.656
SOT223 = smd 1.219 x 2.235: 1 -2.311,-3.099; 2 0,-3.099; 3 2.311,-3.099 | smd 3.6 x 2.2: 4 0,3.099
1X06 = drill 1.016 long: 1 -6.35,0; 2 -3.81,0; 3 -1.27,0; 4 1.27,0; 5 3.81,0; 6 6.35,0
2X03 = drill 1.016 octagon: 1 -2.54,-1.27; 2 -2.54,1.27; 3 0,-1.27; 4 0,1.27; 5 2.54,-1.27; 6 2.54,1.27
1X08 = drill 1.016 long: 1 -8.89,0; 2 -6.35,0; 3 -3.81,0; 4 -1.27,0; 5 1.27,0; 6 3.81,0; 7 6.35,0; 8 8.89,0
0805' = smd 1.2 x 1: 1 -1.1,0; 2 1.1,0
L1812 = smd 1.9 x 3.4: 1 -1.95,0; 2 1.95,0
SM-1206 = smd 1.2 x 1.8: 1 -1.65,0; 2 1.65,0
L0805 = smd 1.016 x 1.397: 1 -0.889,0; 2 0.889,0
CHIP-LED0805 = smd 1.2 x 1.2: A 0,-1.05; C 0,1.05
FIDUCIA-MOUNT = smd 1.016 x 1.016: P$1 0,0
KSS-2EG4430 = smd 1.6 x 1.4: 1 -3.75,0; 2 3.75,0
SOT23 = smd 1.016 x 1.143: 1 -0.95,-1.016; 2 0.95,-1.016; 3 0,1.016
CTS406 = smd 1.9 x 1.4: 1 -2.2,-1.2; 2 2.2,-1.2; 3 2.2,1.2; 4 -2.2,1.2
R0805 = smd 1.15 x 1.5: 1 -0.85,0; 2 0.85,0
M0805 = smd 1.3 x 1.6: 1 -0.95,0; 2 0.95,0
SJ = smd 1.168 x 1.6: 1 -0.762,0; 2 0.762,0
SPARKFUN-PASSIVES_PTH-JUMPER-NC_BOTTOM_NO_SILK = drill 1.016 pad 1.778: 1 -1.27,0; 2 1.27,0
SOT-23 = smd 0.787 x 0.889: 1 0.025,-1.016; 2 -0.94,1.016; 3 0.991,1.016
TO-263A = smd 2.54 x 0.889: 1 5.842,-3.302; 2 5.842,-1.651; 3 5.842,0; 4 5.842,1.651; 5 5.842,3.302 | smd 9.12 x 8.89: TAB -4.531,-0.03
MICROSIM = smd 1.5 x 0.9: 1 -0.8,2.5; 2 -0.8,5.04; 3 -0.8,7.58; 5 -0.8,1.23; 6 -0.8,3.77; 7 -0.8,6.31 | smd 2.61 x 1.56: P$1 1.6,-0.8; P$2 14.2,-0.8; P$3 14.2,16.1; P$4 1.6,16.1
SIM7000 = smd 1.93 x 0.66: 1 -12,8; 2 -12,7; 3 -12,6; 4 -12,5; 5 -12,4; 6 -12,3; 7 -12,2; 8 -12,1; 9 -12,0; 10 -12,-1; 11 -12,-2; 12 -12,-3; 13 -12,-4; 14 -12,-5; 15 -12,-6; 16 -12,-7; 17 -12,-8; 35 12,-8; 36 12,-7; 37 12,-6; 38 12,-5; 39 12,-4; 40 12,-3; 41 12,-2; 42 12,-1; 43 12,0; 44 12,1; 45 12,2; 46 12,3; 47 12,4; 48 12,5; 49 12,6; 50 12,7; 51 12,8 | smd 0.66 x 1.93: 18 -8,-12; 19 -7,-12; 20 -6,-12; 21 -5,-12; 22 -4,-12; 23 -3,-12; 24 -2,-12; 25 -1,-12; 26 0,-12; 27 1,-12; 28 2,-12; 29 3,-12; 30 4,-12; 31 5,-12; 32 6,-12; 33 7,-12; 34 8,-12; 52 8,12; 53 7,12; 54 6,12; 55 5,12; 56 4,12; 57 3,12; 58 2,12; 59 1,12; 60 0,12; 61 -1,12; 62 -2,12; 63 -3,12; 64 -4,12; 65 -5,12; 66 -6,12; 67 -7,12; 68 -8,12
TSSOP20 = smd 0.305 x 0.991: 1 -2.925,-2.918; 2 -2.275,-2.918; 3 -1.625,-2.918; 4 -0.975,-2.918; 5 -0.325,-2.918; 6 0.325,-2.918; 7 0.975,-2.918; 8 1.625,-2.918; 9 2.275,-2.918; 10 2.925,-2.918; 11 2.925,2.918; 12 2.275,2.918; 13 1.625,2.918; 14 0.975,2.918; 15 0.325,2.918; 16 -0.325,2.918; 17 -0.975,2.918; 18 -1.625,2.918; 19 -2.275,2.918; 20 -2.925,2.918
PN61729 = drill 0.95 pad 1.676 octagon: 1 1.25,4.71; 2 -1.25,4.71; 3 -1.25,2.71; 4 1.25,2.71 | drill 2.2: P$1 -6,0; P$2 6,0
4UCONN_20329_V2 = smd 1 x 2: BASE@1 -0.75,-2; BASE@2 0.75,-2 | smd 0.4 x 1.35: D+ 0,0.775; D- -0.65,0.775; GND 1.3,0.775; ID 0.65,0.775; VBUS -1.3,0.775 | drill 1.016 pad 1.454 offset: SPRT@1 -3.3,0.9; SPRT@2 3.3,0.9 | drill 1.397 pad 2.5 square: SPRT@3 -3.6,-1.9; SPRT@4 3.6,-1.9 | hole 0.7: -1.95,0; 1.95,0
DC-21MM = drill 3.302 pad 4.826 octagon: 1 -5.08,-3.353; 2 -0.076,-6.35; 3 -0.076,-0.356

### Placement (x,y rotation side)
C1  17.27,22.78 0 top
C2  27.94,27.84 0 top
C3  42.47,25.4 270 bottom
C4  44.91,25.4 90 bottom
C5  44.45,9.55 180 top
C6  28.07,44.25 180 top
C7  14.83,33.53 270 top
C8  12.4,33.53 270 top
C9  13.82,36.78 0 top
C11  25.6,9.14 0 top
C12  17.07,14.83 90 top
C13  80.06,34.34 90 bottom
C14  76.4,34.34 90 bottom
C15  21.34,14.83 90 top
C16  86.56,34.95 180 bottom
C17  20.6,11.38 180 top
C18  67.46,43.28 270 bottom
C19  29.06,5.16 270 top
C20  71.12,43.69 90 bottom
C21  25.6,5.16 270 top
C22  72.34,23.16 0 bottom
C23  89,50.09 180 top
C24  86.77,28.65 270 bottom
C25  89.61,28.65 270 bottom
C26  83.92,28.65 270 bottom
C27  50.8,37.39 90 top
C28  39.42,33.73 270 top
C29  64.41,21.74 90 top
C30  66.65,43.08 270 top
C31  13,43.69 180 top
C32  89,52.06 0 bottom
C34  71.32,51.21 90 bottom
C35  77.42,50.8 90 bottom
C36  74.17,50.8 90 bottom
D1  17.12,19.2 180 top
D2  73.76,39.22 0 bottom
D4  72.34,10.57 180 bottom
D5  91.03,11.99 180 top
D6  75.39,11.99 180 top
GPS_ANT  93.07,50.09 0 top
IC1  20.93,26.82 90 top
IC2  46.36,16.51 270 top
IC3  20.6,35.2 90 top
IC4  28.22,14.02 270 top
IC5  19,6.3 90 top
JP1  39.37,2.54 0 top
JP2  62.88,27.89 270 top
JP3  32.77,50.8 180 top
JP4  57.15,2.54 0 top
JP5  54.61,50.8 180 top
L1  BLM21  [0805']  7.62,45.09 180 top
L2  4.45,27.3 180 top
L3  67.67,48.97 0 bottom
L4  80.87,16.05 270 top
L5  BLM21  [0805']  82.84,6.61 270 bottom
L6  89,52.06 180 top
LED  27.94,42.11 270 top
LED1  58.42,37.44 270 top
M1  18.42,50.8 0 top
M2  63.37,39.86 0 top
M3  3.73,3.41 0 top
PWR  88.09,15.19 180 top
Q2  85.75,18.9 90 top
Q3  69.9,8.33 90 top
Q4  86.16,8.33 90 top
Q5  69.9,18.9 90 top
Q6  43.69,25.4 180 top
R1  27.99,24.92 180 top
R2  43.08,22.43 180 top
R3  27.84,19.3 180 top
R4  34.34,33.73 180 top
R5  34.34,36.98 180 top
R6  58.32,34.95 0 top
R7  23.37,42.06 180 top
R8  27.84,30.48 0 top
R9  27.84,39.42 0 top
R10  22.83,19.99 0 top
R11  22.89,22.68 180 top
R12  50.8,33.73 90 top
R13  75.18,47.14 180 bottom
R14  71.73,47.14 0 bottom
R15  75.39,43.69 90 bottom
R16  72.34,20.12 0 bottom
R17  72.34,14.22 0 bottom
R18  72.34,17.27 180 bottom
R19  92.46,18.9 270 top
R20  89.41,18.9 90 top
R21  76,8.33 270 top
R22  91.85,8.33 270 top
R23  73.56,8.33 90 top
R24  89.41,8.33 90 top
R25  69.9,11.99 180 top
R26  85.95,11.99 180 top
R27  76.61,18.9 270 top
R28  73.56,18.9 90 top
R29  39.42,37.39 270 top
R30  13,41.66 0 top
R31  89,49.69 0 bottom
RESET  13.82,26.01 270 top
RF_ANT  81.28,51 90 top
RST  72.92,15.21 180 top
RX  27.84,36.78 270 top
SJ1  27.94,22.02 0 top
SJ2  58.12,9.35 0 top
SJ3  58.12,11.99 0 top
T1  5.87,23.75 270 top
TX  27.84,33.73 270 top
U1  84.53,43.69 0 bottom
U2  77.55,23.9 180 bottom
U3  81.28,34.14 0 top
U4  45.11,35.76 90 top
X1  3.81,38.1 270 top
X2  81.08,4.27 0 top
X3  5.33,8.38 90 top

### Tracks (layer width: path | path; a pad name or v marks a point on that pad's centre or on a via)
+3V3  (via drill 0.36)
  Top 0.305: C19.1 C21.1 22.24,6.16 IC5.2
  Top 0.61: 35.56,4.44 JP1.2 | C19.1 29.12,6.1 v30.89,6.1 | v33.93,6.1 33.93,6.07 v33.92,6.08 v33.16,6.08
  Top 0.813: 33.93,6.07 35.56,4.44 | JP1.2 35.56,4.47
  Bottom 0.61: v30.89,6.1 30.9,6.08 v33.92,6.08
+5V  (via drill 0.36, 0.61)
  Top 0.203: 28.99,39.22 R9.2 | IC3.20 | L2.1 5.77,27.3 | 3.45,23.75 T1.1
  Top 0.254: C5.2 43.48,10.16 | 39.5,32.92 C28.2
  Top 0.305: IC3.20 16.21,36.18 15.6,35.56 15.04,35.56 14.83,35.36 C7.1 | R8.2 29.06,30.48 30.48,31.9 30.48,38.61 29.87,39.22 28.99,39.22 | R9.2 28.79,40.5 28.45,40.84 20.93,40.84 19.51,39.42 19.51,37.8 v18.49,36.78 17.88,36.17 IC3.20 | C15.1 21.54,14.24 | 24.9,14.24 IC4.2 | 21.6,8.72 IC5.3 | v21.34,36.78 21.54,36.58 21.54,34.14 22.76,32.92 IC3.4
  Top 0.406: 12.38,34.54 C8.1 C7.1 | 8.89,18.41 v8.25,19.05 | IC1.8 18.12,24.71 C1.2 18.12,24.96 18.08,24.99 v16.46,24.99 | 21.6,13.98 21.54,14.24 | L4.1 80.43,18.45 79.28,19.6 U3.24 | IC2.18 44.35,11.33 43.74,10.72 43.74,10.3 C5.2 43.6,10.17 | 39.5,32.92 40.64,32.92 41.21,33.49 U4.19 44.54,33.49 v46.74,31.29 | 59.44,30.48 59.33,30.58 59.33,34.78 R6.2 | IC1.2 25.02,26.19 25.53,25.68 v25.53,19.3 R3.2 | 48.59,23.19 48.59,25.78 v47.55,26.82 | JP2.2 64.15,30.47 64.13,30.48
  Top 0.508: 47.14,22.15 45.52,22.15 45.15,21.79 IC2.6 | 47.14,22.15 47.55,22.15 v47.62,22.22 | IC2.4 46.75,21.76 47.14,22.15
  Top 0.61: L2.1 6.35,27.35 | C12.1 17.05,13.82 | v14.43,13.31 14.53,13.31 | v78.84,16.05 78.84,16.87 80.43,18.45 | 42.54,10.16 43.6,10.17
  Top 0.813: 6.35,27.35 6.35,31.11 7.62,32.38 9.42,32.38 10.16,33.12 10.16,34.14 10.57,34.54 12.38,34.54 | C12.1 C15.1 | 21.54,14.24 24.9,14.24 | 21.6,8.72 C17.1 21.6,13.98 | 17.05,13.82 v15.04,13.82 14.53,13.31 | v22.76,8.53 22.17,8.53 IC5.3 | 64.13,30.44 64.13,30.48 64.13,31.11 63.19,31.93 60.63,31.93 59.44,30.73 59.44,30.48 59.44,24.13 58.5,23.19 48.59,23.19 v47.62,22.22 | v40.64,13.72 40.64,12.5 42.54,10.59 42.54,10.16 42.54,7.75 42.49,7.75 41.66,6.91 38,6.91 | v31.11,11.28 35.48,6.91 38,6.91 | 38,6.91 38,2.64 JP1.3
  Top 1.016: 5.77,27.3 4.85,26.39 T1.1 2.59,23.72 v2.23,23.37
  Bottom 0.203: v2.23,23.37 2.23,22.96
  Bottom 0.305: v21.34,36.78 v18.49,36.78
  Bottom 0.406: v16.46,24.99 9.55,24.99 9.55,24.38 9.35,24.18 | v47.55,26.82 47.55,30.48 v46.74,31.29
  Bottom 0.61: v15.04,13.82 14.55,13.33 | 38.1,3.76 38.1,3.96 | v25.53,19.3 25.53,18.03 31.11,12.45 v31.11,11.28
  Bottom 0.813: v8.89,21.59 8.51,21.34 9.78,21.34 9.78,21.84 | 14.55,13.33 v8.89,13.33 | JP1.3 38.1,3.76 37.19,4.67 26.62,4.67 v22.76,8.53 v21.64,8.53 | 38.1,3.96 38.81,4.67 72.14,4.67 74.78,7.32 74.78,11.99 v78.84,16.05 | v40.64,13.72 40.64,15.87 46.99,22.22 v47.62,22.22
  other vias: 2.54,21.59 6.99,21.59 2.54,13.33 4.45,13.33 6.99,13.33 8.25,14.83 2.84,23.77
  pour Top (no thermals): 1.91,21.59 2.54,22.23 8.25,22.23 10.16,20.32 10.16,14.61 8.25,12.7 2.54,12.7 1.91,13.33
  pour Bottom (no thermals): 0.89,29.84 10.79,29.84 10.79,20.32 12.7,18.41 12.7,15.88 8.89,12.7 0.89,12.7
  pour Top (no thermals): 1.91,21.59 2.54,22.23 8.25,22.23 10.16,20.32 10.16,14.61 8.25,12.7 2.54,12.7 1.91,13.33
  pour Top (no thermals): 1.27,12.7 1.27,22.23 10.16,22.23 10.16,12.7
AD0
  Top 0.254: IC2.23 48.35,5.09 50.8,2.64 JP4.1
AD1
  Top 0.254: JP4.2 53.34,3.17 52.07,4.44 51.43,4.44 51.05,4.83 51.05,10.57 49.4,12.22 IC2.24
AD2
  Top 0.254: JP4.3 55.88,4.44 55.24,5.08 52.07,5.08 51.71,5.44 51.71,13.44 51.44,13.71 IC2.25
AD3
  Top 0.254: JP4.4 58.42,3.81 56.51,5.71 52.7,5.71 52.35,6.07 52.35,13.97 51.81,14.51 IC2.26
AD4
  Top 0.254: JP4.5 60.96,3.81 58.42,6.35 53.34,6.35 52.98,6.71 52.98,14.6 52.28,15.31 IC2.27
AD5
  Top 0.254: JP4.6 63.5,3.17 59.69,6.98 53.97,6.98 53.62,7.34 53.62,15.34 52.85,16.11 IC2.28
AREF  (via drill 0.36, 0.61)
  Top 0.254: 46.1,12.45 IC2.20
  Top 0.406: JP3.8 23.88,49.15 25.27,47.75 v25.27,45.59 26.62,44.25 C6.2 | v45.92,10.97 45.92,12.19 IC2.20
  Bottom 0.406: v25.27,45.59 26.16,44.7 29.21,44.7 33.15,40.77 33.15,31.88 29.84,28.57 29.84,21.34 28.19,19.68 28.19,16.64 35.56,9.27 44.63,9.27 45.92,10.57 v45.92,10.97
ATMEGA_RXD  (via drill 0.36)
  Top 0.254: v40.64,34.14 U4.18
  Top 0.305: IC2.12 37.55,16.91 v37.39,17.07
  Bottom 0.254: JP3.1 41.66,49.17 40.64,48.16 v40.64,34.14 40.64,31.5 36.78,27.64 36.78,17.68 v37.39,17.07
ATMEGA_TXD  (via drill 0.36)
  Top 0.254: U4.20 42.21,32.82 43.18,32.82 v43.38,32.61
  Top 0.406: v38,19.1 39.37,17.73 42.04,17.73 IC2.11
  Bottom 0.254: JP5.8 45.72,48.97 46.13,48.56 46.13,35.36 v43.38,32.61 37.59,26.82 37.59,19.51 v38,19.1
CMP
  Top 0.406: IC1.3 20.95,27.46 20.32,26.82 20.32,23.37 20.93,22.76 21.92,22.76 R11.2 22,20.04 R10.1
D+
  Top 0.406: 7.11,40.64 7.62,41.15 8.76,41.15 10.48,39.43 IC3.15
  Top 0.61: X1.3 6.52,40.05 7.11,40.64
D-
  Top 0.406: IC3.16 9.78,38.78 9.75,38.81
  Top 0.508: X1.2 9.21,39.35 9.75,38.81
DTR
  Top 0.203: IC3.2 25.27,31.63 25.4,31.5 25.4,28.45 26.01,27.84 C2.1
  Top 0.406: R1.2 27.14,27.79 C2.1
GATE_CMD  (via drill 0.61)
  Top 0.406: IC1.1 22.33,24.92 v21.44,25.81 | v11.81,21.34 10.39,22.76 T1.3
  Bottom 0.406: v11.81,21.34 11.81,20.83 12.83,19.81 20.19,19.81 21.44,21.06 v21.44,25.81
GND  (via drill 0.36, 0.61)
  Top 0.203: 80.06,52.63 79.86,52.83 | IC3.18 16.32,37.48 16.31,37.49
  Top 0.254: 46.6,11.43 IC2.21 | 82.7,51.03 RF_ANT.GND2 82.68,51.13 | 80.06,52.63 81.18,52.63 RF_ANT.GND3 | 79.88,52.81 79.86,52.83 78.05,52.83 C35.2 | 94.61,51.49 94.69,51.41 | 94.69,50.19 GPS_ANT.GND3 94.69,49.99 | 94.61,48.69 94.69,48.77 | GPS_ANT.GND1 93.19,51.49 | GPS_ANT.GND2 93.19,48.69 | RF_ANT.GND1 79.88,51.13
  Top 0.305: JP1.4 JP1.5
  Top 0.406: 82.5,5.69 82.5,5.16 X2.GND | 80.06,52.63 82.5,52.63 | 16.31,37.49 15.53,37.49 C9.2
  Top 0.61: 11.76,45.08 12.62,45.03 | 83.28,6.62 82.5,5.69
  Top 0.813: 11.76,45.08 L1.1 8.85,44.41 4.44,40 4.44,37.46 5.08,36.83 6.5,36.83 X1.4
  Bottom 0.813: X1.4 5.06,36.85 4.44,37.46 4.44,40 5.71,41.27 12.27,41.27
  other vias: 18.31,8.28 18.26,3.96 13.77,5.11 19.61,30.89 50.77,43.46 29.59,35.41 8.59,11.28 53.57,20.27 32.11,35.33 43.69,50.67 48.26,1.78 21.18,30.91 57.28,28.19 30.85,1.68 66.27,10.08 63.47,41.81 66.27,11.58 16.69,26.67 13.21,46.48 21.46,50.67 51.54,26.8 12.04,29.79 54.51,9.73 40.51,22.66 11.68,38 19.71,35.56 84.07,52.24 65.91,52.07 71.73,48.16 76.43,27.84 78.46,20.52 64.29,41.81 65.1,41.81 65.1,41 65.2,39.22 28.3,1.51 25.15,1.51 21.27,1.42 17.22,1.42 48.26,3.2 22.35,35.76 20.78,39.42 18.8,38.25 18.9,35.56 20.17,38.81 18.85,39.32 14.86,23.62 15.47,24.23 11.68,37.13 11.68,36.32 12.04,27.76 19.61,32.92 16.69,25.86 20.14,27.89 20.14,28.7 21.56,28.7 12.37,22.91 11.56,22.91 11.96,22.3 19.53,22 20.55,22 19.53,22.81 19.53,23.62 18.72,16.1 19.74,16.1 18.72,14.88 19.74,14.88 15.47,16.51 15.47,15.7 15.47,14.88 14.66,14.88 22.53,7.47 21.41,7.47 24.77,21.29 24.66,24.13 23.44,24.13 22.23,24.13 22.73,21.29 25.27,27.58 25.68,26.57 26.39,26.57 32.94,20.37 32.33,19.76 31.72,19.15 22.78,10.82 22.78,10.01 26.04,7.57 25.22,7.57 14.66,11.73 17.5,11.73 14.66,10.52 17.5,10.52 26.75,18.03 27.46,18.03 27.46,17.32 65.74,3.2 69.39,3.2 72.44,3.2 72.44,1.37 69.39,1.37 65.74,1.37 71.96,6.22 70.74,6.22 69.32,6.22 67.89,6.22 88.36,5.2 88.21,8.2 78.61,14.34 78.61,13.23 78.61,11.14 78.61,12.16 75.76,10.33 77.18,10.94 75.35,13.99 74.74,13.38 73.73,12.97 71.9,12.97 73.88,10.89 81.25,11.14 80.64,10.53 86.12,16.17 89.78,16.17 89.78,14.55 86.12,14.55 90.19,22.67 90.19,21.25 91.2,21.25 91.2,20.03 91.2,18.81 88,19.83 88,18.81 88,10.48 89.12,10.48 90.24,10.48 94.18,1.37 92.15,1.37 89.92,1.37 89.92,5.03 92.15,5.03 94.18,5.03 91.26,31.7 89.23,31.7 87.2,31.7 85.17,31.7 83.34,31.7 81.71,31.7 79.07,30.48 77.65,30.48 78.26,27.84 91.26,28.04 93.9,24.79 93.9,22.96 85.23,52.22 86.45,52.22 67.34,52.07 68.76,52.07 52.4,43.46 51.59,45.9 50.77,24.36 52.2,24.36 52.6,26.8 43.34,29.03 50.29,9.63 47.4,9.63 47.4,10.69 49.23,10.74 54.32,13.07 54.32,11.85 54.32,10.84 41.83,46.91 44.68,46.91 30.25,47.52 32.89,47.52 35.33,47.52 21.31,46.51 15.04,46.48 17.07,46.48 19.1,46.48 45.08,11.04 45.06,28.96 46.08,28.96 50.65,27.94 51.84,27.94 52.77,27.94 91.34,52.39
  pour Bottom (rank 6): 0.64,52.71 97.36,52.71 97.61,52.45 97.61,0.64 0.89,0.64 0.64,0.89 0.64,30.48 11.43,30.48 11.43,46.36 0.64,46.36
  pour Top (rank 6): 0.64,52.71 97.82,53.11 97.61,0.64 0.64,0.64 0.64,30.48 11.43,30.48 11.43,46.36 0.64,46.36
GNSS_ANT
  Top 0.406: U3.53 88.29,50.09
  Top 0.66: U3.53 | C23.2 88.29,50.09
IO0  (via drill 0.36, 0.61)
  Top 0.406: R4.1 35.19,30.65 35.97,29.87 v55.88,29.87 | IC2.30 56.44,17.71 v57.15,18.41
  Bottom 0.406: JP5.1 63.5,49.28 62.36,48.13 60.45,48.13 59.18,46.86 57.4,46.86 55.88,45.34 v55.88,29.87 55.88,24.51 57.15,23.24 v57.15,18.41
IO1  (via drill 0.36, 0.61)
  Top 0.254: 55.88,19.05 55.88,19.1
  Top 0.305: R5.1 35.19,38.65 36.17,39.62 54.86,39.62 v55.07,39.42
  Top 0.406: IC2.31 55.29,18.51 55.88,19.1 v55.88,19.68
  Bottom 0.406: 60.96,50.55 JP5.2 60.96,49.28 60.58,48.89 59.82,48.89 58.67,47.75 57.02,47.75 55.07,45.8 v55.07,39.42 55.07,23.8 55.88,22.99 v55.88,19.68
IO2  (via drill 0.61)
  Top 0.406: v54.61,20.95 54.61,19.91 54,19.3 IC2.32
  Bottom 0.406: 58.42,50.42 JP5.3 58.42,49.02 58.04,48.64 56.51,48.64 54.36,46.48 54.36,22.48 54.61,22.22 v54.61,20.95
IO3  (via drill 0.61)
  Top 0.305: IC2.1 52.04,20.8 v52.32,21.08
  Bottom 0.406: JP5.4 55.88,49.78 53.59,47.5 53.59,22.61 52.32,21.34 v52.32,21.08
IO4  (via drill 0.61)
  Top 0.305: IC2.2 48.35,21.74 48.56,21.95 50.11,21.95 v50.16,22
  Bottom 0.406: JP5.5 53.21,50.29 49.78,46.86 49.78,34.67 49.02,33.91 49.02,24.26 50.16,23.11 v50.16,22
IO5  (via drill 0.61)
  Top 0.406: v40.66,20.93 40.66,19.89 41.25,19.3 IC2.9
  Bottom 0.406: JP5.6 50.8,50.29 48.64,48.13 48.64,35.59 39.23,26.18 39.23,22.36 v40.66,20.93
IO6  (via drill 0.61)
  Top 0.406: v39.6,19.46 39.62,19.46 40.59,18.49 42.04,18.49 IC2.10
  Bottom 0.406: JP5.7 48.26,49.53 47.5,48.77 47.37,35.43 38.41,26.31 38.41,20.69 38.44,20.67 v39.6,19.46
IO9  (via drill 0.61)
  Top 0.305: IC2.13 35.96,16.11 v34.92,17.14
  Bottom 0.406: JP3.2 39.12,31.11 35.56,27.56 35.56,17.78 v34.92,17.14
M8RXD  (via drill 0.36)
  Top 0.254: R4.2 v32.31,33.73 | IC3.1 24.25,30.41 v24.38,30.28
  Bottom 0.254: v32.31,33.73 32.11,33.53 32.11,32.51 29.87,30.28 v24.38,30.28
M8TXD  (via drill 0.36)
  Top 0.254: v32.11,36.98 R5.2
  Top 0.305: IC3.5 24.94,33.58 v25.81,32.72
  Bottom 0.254: v25.81,32.72 26.21,32.31 30.28,32.31 31.29,33.32 31.29,36.17 v32.11,36.98
MISO  (via drill 0.36, 0.61)
  Top 0.305: IC2.16 42.06,13.59 43.05,13.59 43.48,14.02 43.48,14.83 v43.45,14.87
  Bottom 0.406: JP3.5 31.5,46.23 35.05,42.67 35.05,31.24 32.38,28.57 32.38,21.34 29.84,18.8 29.84,17.53 33.85,13.53 v35.12,13.53 36.07,12.57 41.15,12.57 v43.45,14.87 44.2,15.62 58.72,15.62 59.31,16.21 59.31,28.32 61.42,30.43 JP2.1
MOSI  (via drill 0.36, 0.61)
  Top 0.254: v37.97,10.67 36.32,10.67 33.27,13.72 33.27,14.6
  Top 0.305: 33.02,14.6 33.12,14.71 33.12,14.83 | 33.12,14.83 33.12,15.65 31.75,17.02 v31.75,17.78 | SJ3.1 v56.84,13.84 | IC2.15 33.44,14.51 33.12,14.83
  Top 0.61: 33.27,14.6 33.02,14.6
  Bottom 0.406: JP3.4 34.04,45.85 36.32,43.56 36.32,30.99 33.65,28.32 33.65,19.68 v31.75,17.78 | JP2.4 64.15,27.83 62.89,26.57 62.89,24.69 60.96,22.76 60.96,14.86 59.94,13.84 v56.84,13.84 47.88,13.84 46.99,12.95 44.96,12.95 42.67,10.67 v37.97,10.67
N$1
  Top 0.203: LED.A 24.27,42.11 R7.1
N$2
  Bottom 0.203: R14.1 72.62,46.46 72.95,46.13 75.79,46.13 76,46.33 76,47.07
  Bottom 0.305: U1.5 76.22,46.99 R13.2 76,47.07
N$3
  Top 0.203: R6.1 57.47,36.73 LED1.A
N$4  (via drill 0.36)
  Top 0.305: T1.2 11.07,24.69 v13.82,27.43 | v31.09,40.44 58.93,40.44
  Bottom 0.305: v13.82,27.43 13.82,37.59 16.66,40.44 v31.09,40.44 | 71.53,40.03 71.53,39.25 D2.A
  other vias: 59.54,42.88 13.82,28.19 14.63,27.43 13.21,26.62 14.12,26.62 15.04,26.62 14.63,28.19 31.09,41.15 31.09,39.73 31.14,38.05 31.14,38.86 31.95,38.86 31.95,38.05 31.9,39.73 31.9,40.44 60.35,42.88 61.16,42.88 61.98,42.88 61.98,42.06 61.98,41.25 61.16,41.25 61.16,42.06 60.35,42.06 59.54,42.06 60.35,41.25 59.54,41.25
  pour Top (no thermals): 5.89,25.2 10.57,25.2 13.41,28.04 13.41,28.45 15.65,28.45 15.65,25.2 13.82,23.57 5.89,23.57
  pour Bottom (no thermals): 12.8,25.81 12.8,41.66 16.05,44.91 28.45,44.91 32.72,40.64 32.72,37.8 29.26,37.8 27.03,40.03 18.69,40.03 16.05,37.39 16.05,25.81
  pour Top (no thermals): 30.89,37.8 30.89,38.81 30.07,39.62 30.07,42.27 56.49,42.27 57.51,43.28 62.59,43.28 62.59,41.45 61.16,40.03 35.97,40.03 34.75,38.81 34.75,38 32.92,38 32.72,37.8
  pour Bottom (no thermals): 59.13,43.28 59.13,37.19 66.85,37.19 67.87,36.17 73.56,36.17 73.56,41.45 69.7,41.45 69.7,38.81 69.49,38.61 64.21,38.61 62.79,39.83 62.79,43.28
N$5
  Top 0.203: C9.1 12.8,36.8 12.8,37.8 13.31,38.3 15.9,38.3 16.05,38.15 16.92,38.15 IC3.17
N$6
  Top 0.305: Q3.3 68.88,11.46 R25.2
N$7
  Top 0.305: R25.1 D6.-
N$8
  Top 0.305: R21.2 R23.1 70.98,7.44 Q3.1
N$9
  Top 0.203: R8.1 26.89,33.63 TX.A
N$10
  Bottom 0.305: U2.7 73.55,17.59 R18.2
N$11  (via drill 0.36)
  Top 0.254: R9.1 v26.62,39.42 | RX.A 26.79,36.81 v26.62,36.98
  Bottom 0.254: v26.62,39.42 v26.62,36.98
N$12
  Bottom 0.305: R17.1 74.65,14.22 U2.3
N$13
  Bottom 0.305: U2.2 74.48,18.86 R16.1
N$14
  Top 0.254: R27.2 R28.1 70.98,18.01
  Top 0.305: 70.98,18.01 Q5.1
N$15
  Top 0.406: X2.VBUS 79.78,13.01 L4.2
N$16
  Top 0.305: R26.2 85.06,8.41 Q4.3
N$17
  Top 0.305: D5.- R26.1
N$18
  Top 0.305: Q4.1 89.35,7.38 R24.1 R22.2
N$19
  Top 0.406: GPS_ANT.D C23.1 89.89,51.89 L6.1
N$20
  Top 0.254: U4.9 48.93,38.04 49.58,37.39 51.61,37.39 52.22,36.78 52.22,33.73 51.41,32.92 50.67,32.92 R12.1
N$21
  Top 0.254: R29.1 41.07,38.28 41.3,38.05 42.18,38.05 U4.12
N$22  (via drill 0.36)
  Top 0.254: L6.2 88.07,51.89 v88.07,52.06
  Bottom 0.254: R31.1 89.89,50.07 v88.07,52.06 C32.2
N$23
  cutout Top (no thermals): 80.06,52.37 82.5,52.37 82.5,49.78 80.06,49.78
N$24
  cutout Top (no thermals): 92.05,51.41 94.08,51.41 94.08,48.77 92.05,48.77
N$27
  pour Top: 0.64,52.58 11.81,52.58 11.81,47.2 0.64,47.2
N$28
  cutout Top: 75.18,0.61 75.18,5.69 75.64,6.2 86.46,6.2 86.97,5.69 86.97,0.61
N$36
  Top 0.305: Q2.1 89.35,17.95 R20.1 R19.2
NETLIGHT
  Top 0.406: U3.52 94.27,46.14 95.1,45.31 95.1,10.57 93.75,9.22 R22.1
PWRIN
  Top 0.406: R10.2 23.57,19.84 23.57,18.9 23.37,18.69 21.34,18.69 20.93,19.1 20.93,20.73 20.52,21.13 15.65,21.13 15.29,20.78 15.29,19.57 D1.A
  Top 0.61: D1.A 13,17.29 13,9.63 X3.2
  pour Top (no thermals): 8.94,7.11 8.94,9.55 10.97,11.58 10.97,18.9 12.6,20.52 16.66,20.52 16.87,20.32 16.87,17.68 16.66,17.48 15.04,17.48 13.61,16.05 13.61,9.96 14.02,9.55 14.02,6.71 13,5.69 10.36,5.69
PWRKEY  (via drill 0.36)
  Top 0.254: C30.2 69.23,42.19 U3.1
  Top 0.305: PWR.2 84.73,15.15 Q2.3 v84.73,20.12 | v76.81,29.67 76.81,38.2 72.95,42.06 69.35,42.06 U3.1
  Bottom 0.305: v84.73,20.12 84.73,21.74 82.7,23.77 82.7,28.24 81.69,29.26 77.22,29.26 v76.81,29.67
RESET  (via drill 0.36, 0.61)
  Top 0.254: RESET.1 13.93,29.87 v16.87,29.87 | v27.94,29.16 28.79,28.31 C2.2
  Top 0.406: SJ1.1 SJ1.2 28.69,22.01 R3.1 30.28,19.3 30.48,19.1 | JP2.5 61.61,20.33 v58.24,16.97 58.18,16.91 IC2.29 | JP1.1 32.38,3.17 32.38,7.65 29.26,10.77 29.26,17.48 30.48,18.69 30.48,19.1 | 30.48,27.23 30.48,27.3 31.39,28.22 48.39,28.22 51.21,25.4 v57.15,25.4 | C2.2 29.87,27.84 30.48,27.23 | 30.48,27.23 30.48,19.1
  Bottom 0.254: v16.87,29.87 17.27,29.46 27.63,29.46 v27.94,29.16
  Bottom 0.406: v58.24,16.97 58.24,24.31 v57.15,25.4
RF_ANT
  Top 0.406: RF_ANT.D U3.60
RXLED
  Top 0.203: RX.C 28.89,37.76 28.65,38 26.01,38 25.6,38.4 25.6,39.83 25.2,40.23 22.55,40.23 20.32,38 20.32,35.15 20.01,34.85 16.97,34.85 IC3.22
SCK  (via drill 0.36, 0.61)
  Top 0.203: R7.2 22.52,45.89 v23.37,46.74
  Top 0.305: v55.07,14.73 55.07,10.57 56.29,9.35 SJ2.1
  Top 0.406: IC2.17 42.65,12.22 v42.37,12.5
  Bottom 0.203: v23.37,46.74 28.83,46.74 28.96,46.86
  Bottom 0.406: JP2.3 61.54,27.89 60.07,26.42 60.07,15.47 59.33,14.73 v55.07,14.73 44.6,14.73 v42.37,12.5 41.68,11.81 34.29,11.81 29.08,17.02 29.08,19.3 31.11,21.34 31.11,28.57 34.16,31.62 34.16,41.66 28.96,46.86 JP3.6
SHIELD
  Top 0.61: X2.SPRT@1 77.78,2.67 X2.SPRT@3 80.23,2.37 X2.BASE@1 X2.BASE@2 84.58,2.27 X2.SPRT@4 84.68,4.87 X2.SPRT@2
  pour Bottom (no thermals): 75.18,0.61 75.18,5.69 75.64,6.2 86.46,6.2 86.97,5.69 86.97,0.61
SIM7000_PWRKEY_MCU  (via drill 0.36)
  Top 0.254: R19.1 93.8,19.79 94.08,19.51 94.08,14.43 93.27,13.61 84.53,13.61 84.12,13.21 84.12,10.57 81.9,8.34 81.9,6.71 v81.89,6.71 | SJ2.2 63.45,5.28 74.17,5.28 75.39,6.5 77.22,6.5 v77.42,6.71
  Bottom 0.254: v81.89,6.71 v77.42,6.71
SIM7000_RESET
  Top 0.254: C29.2 67.39,22.63 67.46,22.56
  Top 0.305: RST.2 69.17,18.61 Q5.3 68.88,20.93 67.46,22.35 67.46,22.56 67.46,26.62 67.98,27.14 U3.16
SIM7000_RESET_MCU
  Top 0.254: SJ3.2 60.96,11.99 62.48,13.51 71.32,13.51 74.47,16.66 77.62,16.66 78.23,17.27 78.23,19.51 77.95,19.79 R27.1
SIM7000_RXD  (via drill 0.36)
  Top 0.254: U4.3 48.97,34.14 49.38,33.73 49.38,31.9 49.78,31.5 56.29,31.5 57.1,32.31 v58.11,32.31 | 69.06,32.92 U3.10 69.26,33.12 67.87,33.12 67.06,32.31 v66.65,32.31
  Bottom 0.254: v58.11,32.31 v66.65,32.31
SIM7000_TXD  (via drill 0.36)
  Top 0.254: U4.1 48.03,32.44 49.58,30.89 v57.1,30.89 | U3.9 67.87,34.14 v67.26,33.53
  Bottom 0.254: v57.1,30.89 57.1,32.72 57.91,33.53 v67.26,33.53
SIM_CLK  (via drill 0.36)
  Top 0.254: U3.32 87.28,24.07 v85.75,25.6 71.68,25.6 v71.63,25.55 | v67.67,20.93 67.67,14.63 68.17,14.12 71.02,14.12 v71.42,14.53
  Bottom 0.203: D4.5 72.34,8.53 72.14,8.33 71.12,8.33 70.51,8.94 70.51,13.28 R17.2 | v85.75,25.6 86.56,25.6 86.77,25.81 C24.2
  Bottom 0.254: v67.67,20.93 67.67,21.59 v71.63,25.55
  Bottom 0.305: v71.42,14.53 71.42,14.2 R17.2
SIM_DATA  (via drill 0.36)
  Top 0.305: U3.31 86.28,23.85 85.34,24.79 v83.92,24.79 72.54,24.79 69.9,22.15 v69.9,16.66
  Bottom 0.203: D4.4 73.09,8.27 72.54,7.72 70.71,7.72 68.07,10.36 68.07,11.79 66.04,13.82 66.04,14.63 67.06,15.65 69.9,15.65 | 69.9,15.65 69.9,15.72 | 69.9,15.72 R18.1 71.45,17.2 69.9,15.65 | 69.9,15.72 v69.9,16.66 | v83.92,24.79 C26.2
SIM_RST  (via drill 0.36)
  Top 0.254: U3.33 88.28,24.29 v87.58,24.99 85.95,26.62 v71.63,26.62 | v66.65,20.93 v66.65,14.22
  Bottom 0.203: 71.43,20.1 71.43,18.99 71.73,18.69 72.14,18.69 72.34,18.49 72.34,15.85 | 72.34,15.85 72.34,13.41 73.15,12.6 73.15,11.83 D4.3 | v66.65,14.22 66.9,13.97 70.15,13.97 70.46,14.27 70.46,15.39 70.92,15.85 72.34,15.85 | v87.58,24.99 88.8,24.99 89.61,25.81 C25.2
  Bottom 0.254: v66.65,20.93 66.65,21.64 v71.63,26.62
  Bottom 0.305: 71.43,20.1 R16.2
SIM_USB_DM  (via drill 0.36)
  Top 0.406: X2.D- 80.43,9.1 v83.31,11.99 | v83.31,17.07 83.31,22.11 U3.28
  Bottom 0.406: v83.31,11.99 v83.31,17.07
SIM_USB_DP  (via drill 0.36)
  Top 0.406: X2.D+ 81.08,8.53 v82.3,9.75 | v82.3,19.71 82.3,22.12 U3.27
  Bottom 0.406: v82.3,9.75 v82.3,19.71
SIM_VDD  (via drill 0.36)
  Top 0.305: U3.30 85.28,23.64 84.94,23.98 v73.35,23.98
  Bottom 0.203: 73.35,21.4 70.58,21.4 69.29,20.12 69.29,17.27 68.07,16.05 66.85,16.05 65.63,14.83 65.63,13.61 67.67,11.58 67.67,9.96 70.51,7.11 72.75,7.11 73.76,8.13 73.76,10.16 73.56,10.36 71.93,10.36 71.59,10.71 D4.1
  Bottom 0.305: U2.1 73.35,21.4 73.23,21.53 C22.1 73.15,23.24 73.15,23.77 v73.35,23.98
SS  (via drill 0.61)
  Top 0.305: IC2.14 34.83,15.31 v33.02,17.12
  Bottom 0.406: JP3.3 36.58,45.47 37.59,44.45 37.59,30.86 34.54,27.81 34.54,18.67 33.02,17.14 v33.02,17.12
STATUS  (via drill 0.36)
  Top 0.406: U3.66 75.28,42.98 80.87,37.39 v80.87,27.84 | v78.64,10.16 76.94,10.16 R21.1
  Bottom 0.406: v80.87,27.84 80.87,12.4 v78.64,10.16
TXLED  (via drill 0.36, 0.36 pad 0.76)
  Top 0.203: TX.C 28.89,34.71 28.24,35.36 v25.6,35.36 | IC3.23 18.38,34.23 v18.59,34.04
  Bottom 0.203: v18.59,34.04 24.28,34.04 v25.6,35.36
USHIELD  (via drill 0.61)
  Top 0.813: L1.2 4.79,45.08 X1.P$1 | R30.1 10.67,41.66 v9.52,42.8 10.41,43.69 C31.2
  Bottom 0.61: v9.52,42.8 5.11,42.8 X1.P$1
  Bottom 0.813: X1.P$2 3.68,34.67 2.67,35.69 2.67,41.78 3.81,42.93 X1.P$1
V+  (via drill 0.36)
  Top 0.254: D6.+ 77.42,11.99 v77.83,11.58 | v91.85,10.57 91.85,11.91 D5.+
  Top 0.305: D5.+ 93.47,11.99 v93.67,12.19 | v91.44,22.56 86.16,27.84 86.16,46.01 U3.55
  Bottom 0.254: v77.83,11.58 77.83,9.55 78.23,9.14 91.44,9.14 91.85,9.55 v91.85,10.57 | R31.2 85.84,49.69 v85.55,49.99
  Bottom 0.305: v93.67,12.19 93.67,20.32 v91.44,22.56
  other vias: 84.12,50.8 84.84,50.8 85.55,50.8 84.12,49.99 84.84,49.99 84.12,49.17 84.84,49.17 85.55,49.17
  pour Top (no thermals): 83.92,44.7 83.92,51 85.75,51 85.75,49.58 86.46,48.82 86.46,44.7
  pour Bottom (no thermals): 68.94,50.8 78.64,50.8 78.64,49.17 83.31,49.17 83.52,49.38 83.52,51 83.72,51.21 85.95,51.21 86.16,51 86.16,49.38 86.77,48.77 86.77,46.94 80.92,46.94 80.06,47.8 77.67,47.8 76.66,48.82 68.94,48.82
VDD_EXT
  Top 0.254: U3.15 69.18,28.04 67.26,28.04 65.84,29.46 65.84,32.92 60.15,38.61 56.29,38.61 55.96,38.28 C27.2 50.19,38.69 U4.10 47.22,38.69 46.74,38.2 46.74,33.93 47.18,33.49 U4.2
VIN  (via drill 0.36)
  Top 0.406: C11.1 24.6,11.19 IC4.3
  Top 0.61: D1.C 21.23,17.29 v21.74,17.07 | IC4.3 25.25,11.84 v27.48,11.84 v28.09,11.23
  Top 1.016: v45.72,7.52 JP1.6
  Bottom 0.61: v21.74,17.07 v27.48,11.84 31.24,8.08 45.16,8.08 v45.72,7.52
  other vias: 21.74,17.88 22.56,17.88 23.37,17.88 23.37,17.07 22.56,17.07 45.72,6.71 45.72,5.89 44.09,7.52 44.09,6.71 44.09,5.89 47.14,7.52 47.14,6.71 47.14,5.89
  pour Bottom (no thermals): 74.78,34.75 74.78,41.66 76.2,41.66 77.01,42.47 82.5,42.47 82.91,42.06 82.91,37.8 83.72,36.98 86.16,36.98 86.56,36.58 86.56,33.53 82.3,33.53 82.09,33.73 82.09,34.14 81.48,34.75
  pour Bottom (rank 2, no thermals): 68.28,37.39 77.42,37.39 77.42,34.75 75.59,34.75 75.18,34.34 75.18,28.85 74.37,28.04 72.54,28.04 66.24,21.74 66.24,16.46 65.02,15.24 65.02,9.55 63.8,8.33 63.8,5.89 63.4,5.49 45.31,5.49 44.91,5.89 44.91,8.33 45.11,8.74 55.27,8.74 55.88,7.92 60.35,7.92 61.57,9.14 61.57,19.1 62.79,20.32 62.79,22.76 63.8,23.77 64.82,23.77 65.84,24.79 65.84,32.31 68.28,34.75
  pour Top (no thermals): 18.08,20.52 18.08,17.27 18.49,16.87 23.57,16.87 23.57,18.29 20.73,18.29 20.32,18.69 20.32,20.52
  pour Bottom (no thermals): 21.54,18.29 21.54,13.41 28.04,6.91 34.75,6.91 36.17,5.49 46.94,5.49 46.94,8.53 35.36,8.53 34.14,9.75 31.09,9.75 24.79,16.05 24.79,18.29
  pour Top (no thermals): 45.11,1.02 45.11,3.25 43.48,4.88 43.48,8.33 47.75,8.33 47.75,4.67 46.33,3.25 46.33,1.02
VOUT
  Bottom 0.254: R14.2 68.15,47.14 C18.+
  pour Bottom (no thermals): 67.67,51 65.43,51 65.43,44.09 65.84,43.69 76.2,43.69 77.01,44.5 80.26,44.5 80.47,44.7 80.47,45.92 80.26,46.13 67.67,46.13
XTAL1  (via drill 0.36)
  Top 0.254: v44.55,26.57 45.54,26.6 Q6.1 44.54,25.25 44.54,25.23 44.09,24.79 44.09,22.59 R2.1
  Top 0.305: R2.1 44.35,22.25 IC2.7
  Bottom 0.254: v44.55,26.57 44.31,26.57 C4.2
XTAL2  (via drill 0.36)
  Top 0.254: 42.25,24.2 Q6.3 42.08,24.79 v42.96,24.79
  Top 0.305: 42.25,24.2 42.25,22.45 R2.2 42.23,22.13 IC2.8
  Bottom 0.254: C3.2 42.63,24.55 v42.96,24.79
XUSB
  Top 0.813: L2.2 2.49,27.98 1.4,29.08 1.4,33.78 2.54,34.92 7.62,34.92 8.51,35.81 X1.1

### Text on the board
tPlace: AREF | GND | 13 | 12 | 11 | 10 | 9 | 8 | 7 | 6 | 5 | 4 | 3 | 2 | 1 | 0 | SIM7000 | # | # | # | # | # | # | DIGITAL | [#=PWM] | TX | RX | + | FTDI | PWR | + | + | + | Ideamart NB-IoT/eMTC/GSM/LTE / Development Board / Version 1.1 | ICSP | DC IN / 7-12V | RST | + | + | STAT | NET | PWRKEY | ANALOG IN | RESET | 3V3 | 5V | GND | GND | VIN | A0 | A1 | A2 | A3 | A4 | A5
bStop: 2018/06/01
ReferenceLC: L | TX | RX | PC1 | PC2
tDocu: Reference Designs ARE PROVIDED "AS IS" AND "WITH ALL FAULTS. Arduino DISCLAIMS ALL OTHER WARRANTIES, EXPRESS OR IMPLIED, | REGARDING PRODUCTS, INCLUDING BUT NOT LIMITED TO, ANY IMPLIED WARRANTIES OF MERCHANTABILITY OR FITNESS FOR A PARTICULAR PURPOSE | Arduino may make changes to specifications and product descriptions at any time, without notice. The Customer must not | rely on the absence or characteristics of any features or instructions marked "reserved" or "undefined." Arduino reserves | these for future definition and shall have no responsibility whatsoever for conflicts or incompatibilities arising from future changes to them. | The product information on the Web Site or Materials is subject to change without notice. Do not finalize a design with this information. | Original Design By: | M.Banzi | D.Cuartielles | T.Igoe | G.Martino | D.Mellis
214bmp: D:/SmartProjects/Snc/a4_bn_logo2.bmp